# EAGLE design base-alt-pkg (EAGLE 9.2.0)
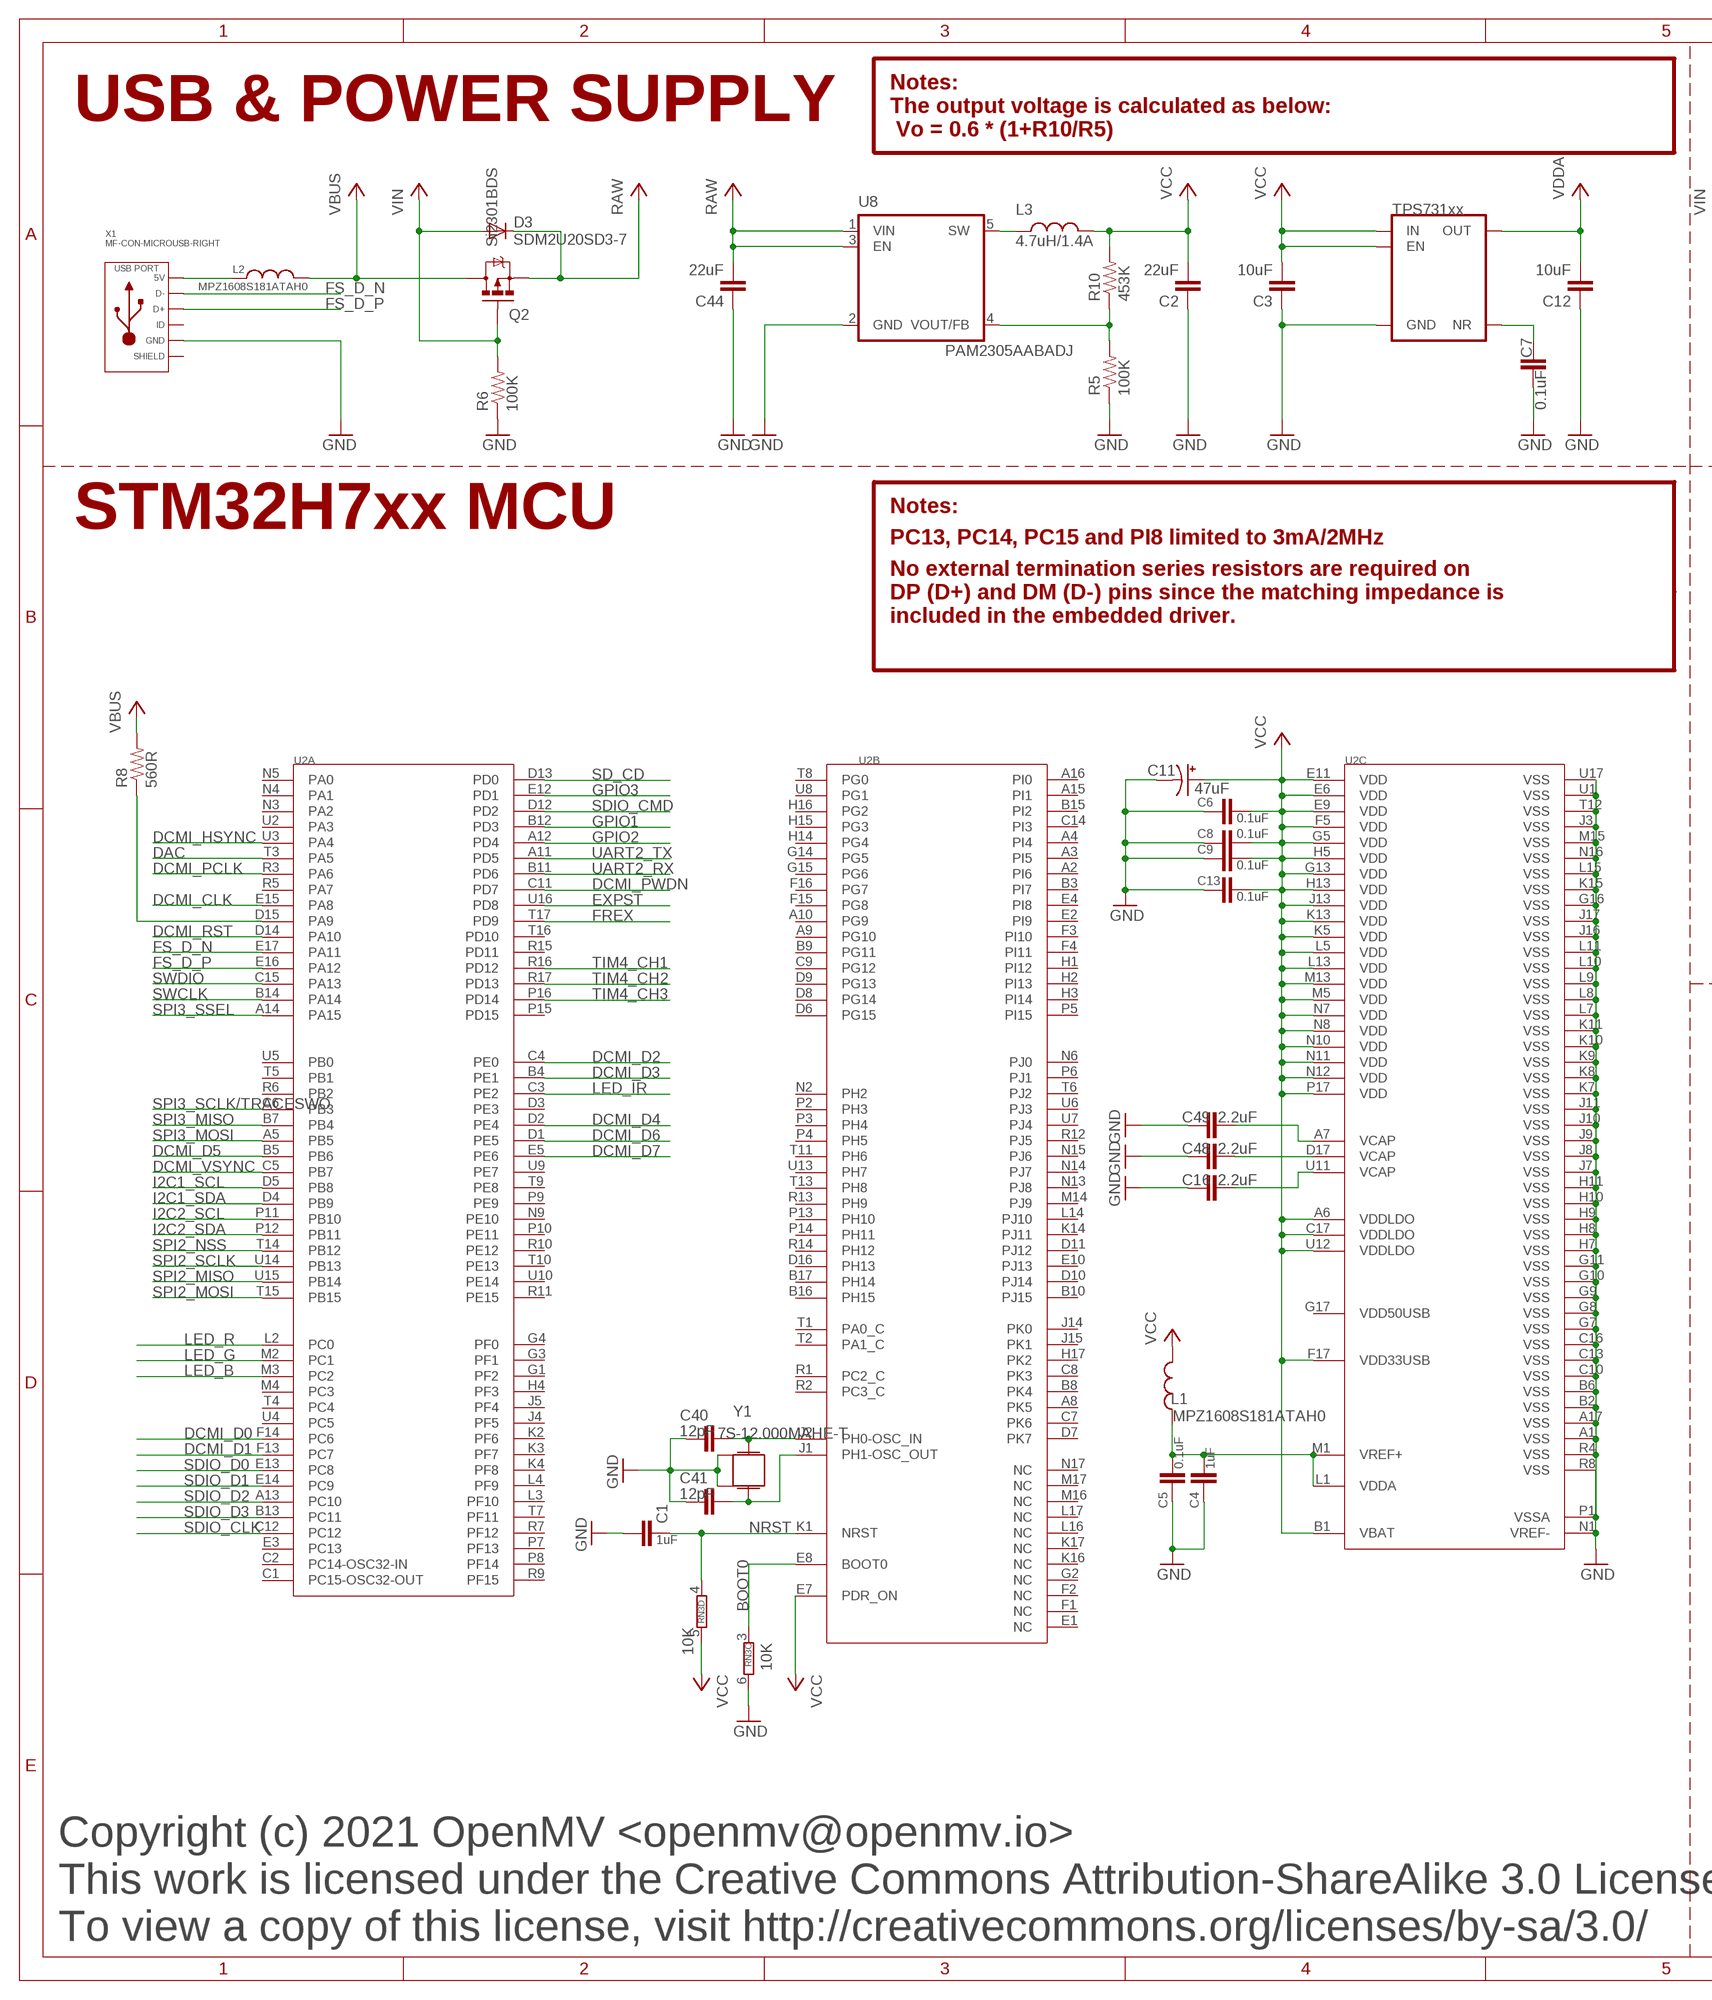
[diagram p0: schematic, sheet 1, part 1 of 2]
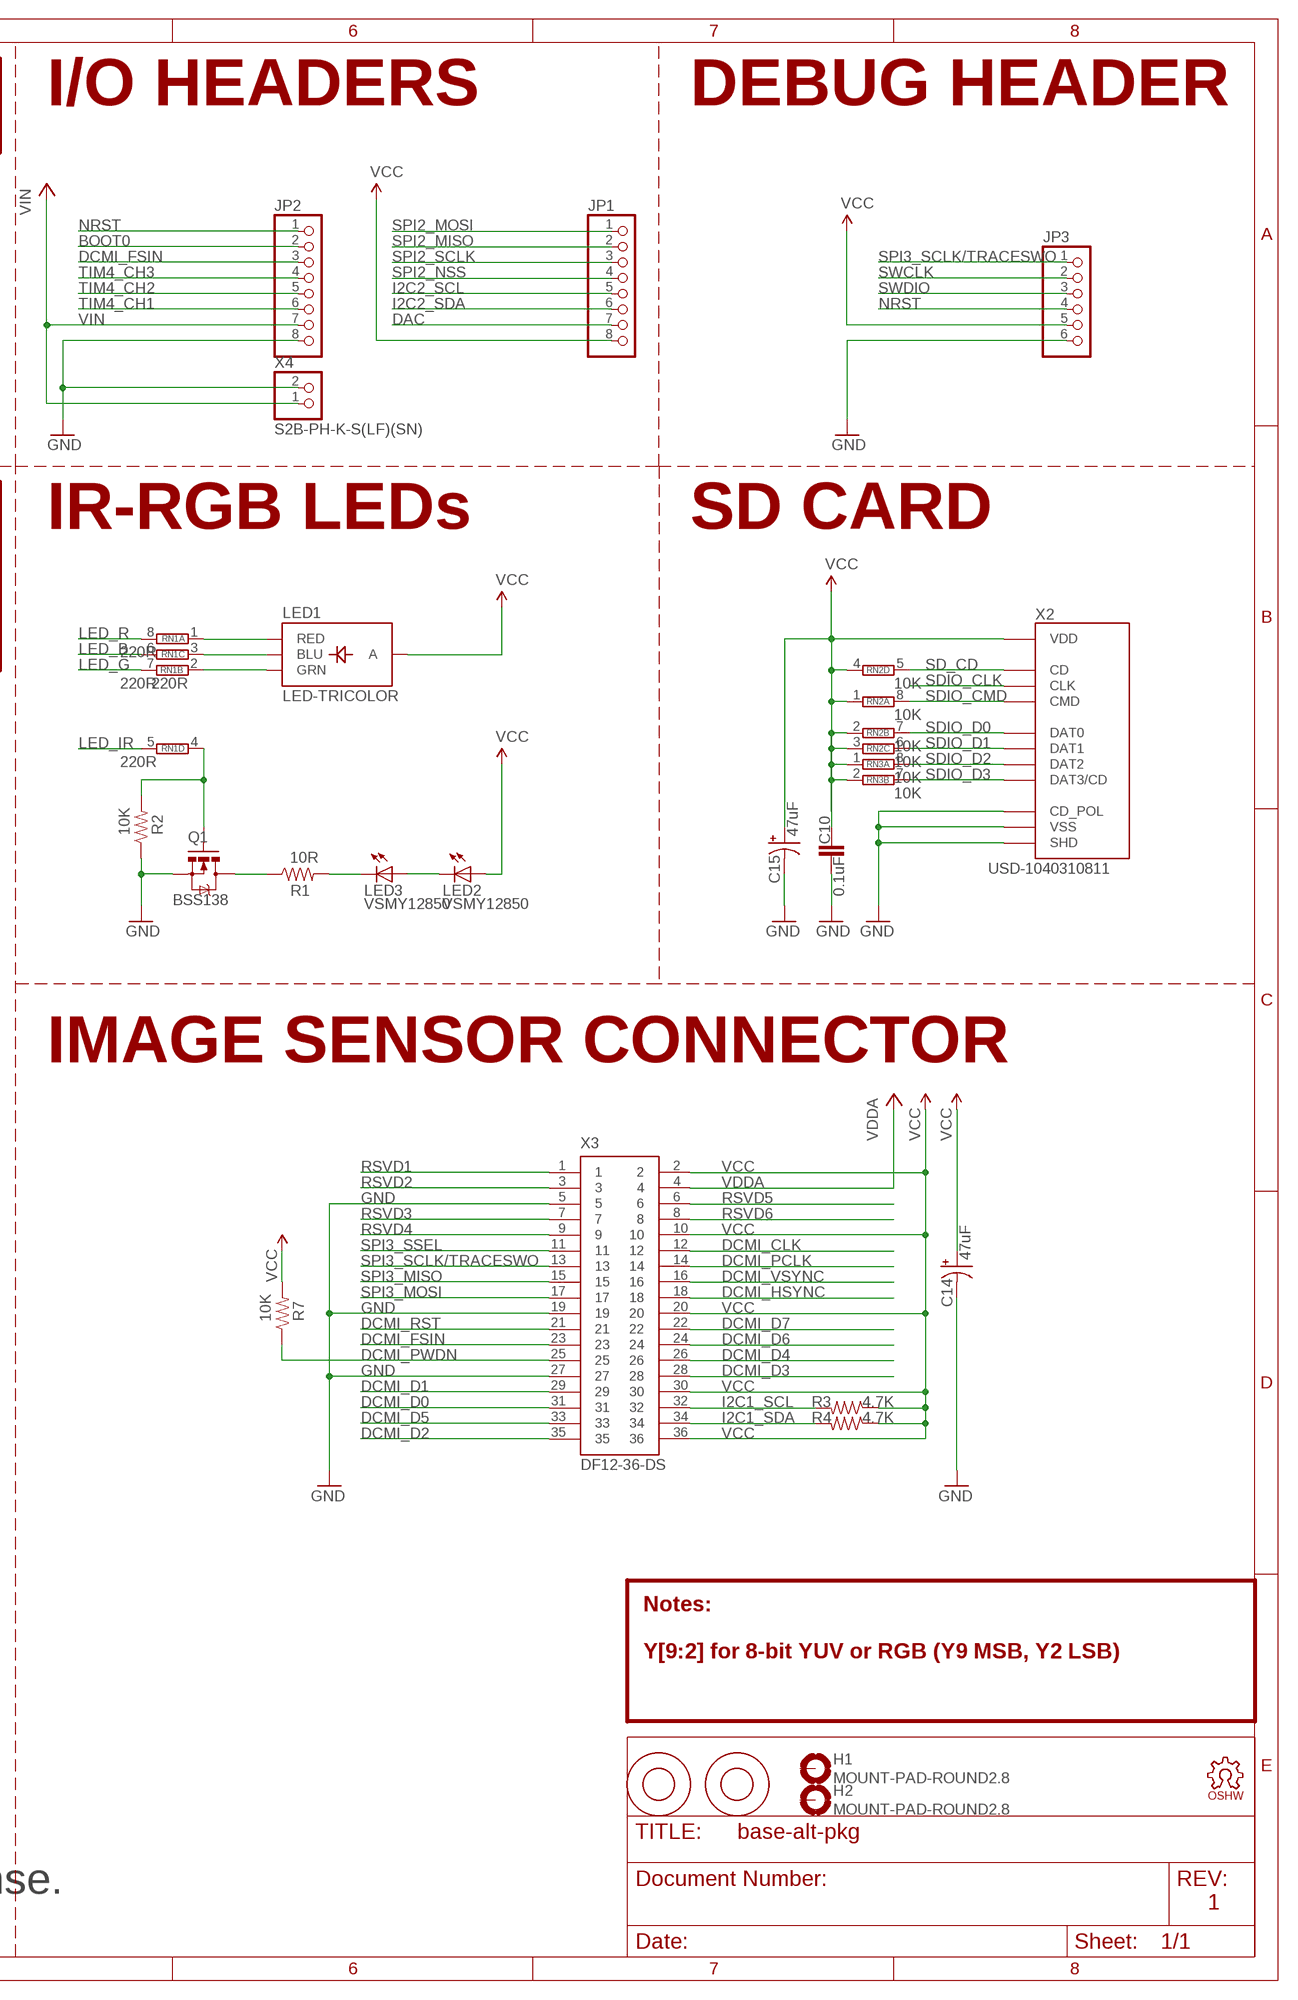
[diagram p1: schematic, sheet 1, part 2 of 2]

## Parts
C1  1uF  CAP0603-CAP  [0603-CAP]
C2  22uF  CAP0805  [0805]
C3  10uF  CAP0805  [0805]
C4  1uF  CAP0603-CAP  [0603-CAP]
C5  0.1uF  CAP0603-CAP  [0603-CAP]
C6  0.1uF  CAP0603-CAP  [0603-CAP]
C7  0.1uF  CAP0603-CAP  [0603-CAP]
C8  0.1uF  CAP0603-CAP  [0603-CAP]
C9  0.1uF  CAP0603-CAP  [0603-CAP]
C10  0.1uF  CAP0603-CAP  [0603-CAP]
C11  47uF  CAP_POL1206  [EIA3216]
C12  10uF  CAP0805  [0805]
C13  0.1uF  CAP0603-CAP  [0603-CAP]
C14  47uF  CAP_POL1206  [EIA3216]
C15  47uF  CAP_POL1206  [EIA3216]
C16  2.2uF  CAP0603-CAP  [0603-CAP]
C40  12pF  CAP0603-CAP  [0603-CAP]
C41  12pF  CAP0603-CAP  [0603-CAP]
C44  22uF  CAP0805  [0805]
C48  2.2uF  CAP0603-CAP  [0603-CAP]
C49  2.2uF  CAP0603-CAP  [0603-CAP]
D3  SDM2U20SD3-7  DIODESOD  [SOD-323]
H1  MOUNT-PAD-ROUND2.8  [2,8-PAD]
H2  MOUNT-PAD-ROUND2.8  [2,8-PAD]
JP1  PINHD-1X8  [1X08]
JP2  PINHD-1X8  [1X08]
JP3  PINHD-1X6  [1X06]
L1  MPZ1608S181ATAH0  INDUCTOR0603  [0603]
L2  MPZ1608S181ATAH0  INDUCTOR0603  [0603]
L3  4.7uH/1.4A  INDUCTOR1007  [1007]
LED1  LED-TRICOLOR  [LED-TRICOLOR-SMD-MF]
LED2  VSMY12850  LED1206  [LED-1206]
LED3  VSMY12850  LED1206  [LED-1206]
LOGO1  OSHW_LOGO_FILLX0100-NT  [OSHW_FILLX100_NOTEXT]
M1  9774030243R  9774030151R  [9774030151R]
M2  9774030243R  9774030151R  [9774030151R]
Q1  BSS138  MOSFET-NCHANNELSMD  [SOT23-3]
Q2  Si2301BDS  MOSFET-PCHANNELSMD  [SOT23-3]
R1  10R  RESISTOR0603-RES  [0603-RES]
R2  10K  RESISTOR0603-RES  [0603-RES]
R3  4.7K  RESISTOR0603-RES  [0603-RES]
R4  4.7K  RESISTOR0603-RES  [0603-RES]
R5  100K  RESISTOR0603-RES  [0603-RES]
R6  100K  RESISTOR0603-RES  [0603-RES]
R7  10K  RESISTOR0603-RES  [0603-RES]
R8  560R  RESISTOR0603-RES  [0603-RES]
R10  453K  RESISTOR0603-RES  [0603-RES]
RN1  220R  4R-NEXBV8V  [EXBV8V]
RN2  10K  4R-NEXBV8V  [EXBV8V]
RN3  10K  4R-NEXBV8V  [EXBV8V]
U2  STM32H743XIH6  STM32H743XIH6STM32H743XIH6_TFBGA240+25  [TFBGA240+25]
U5  TPS731XX  [SOT23-5]
U8  PAM2305AABADJ  PAM2305AAB330  [TSOT25]
X1  MF-CON-MICROUSB-RIGHT  USB_MICRO_RIGHT  [MICROUSB-RIGHT]
X2  USD-1040310811  [1040310811]
X3  DF12-36-DS  [DF12-36-DS]
X4  S2B-PH-K-S(LF)(SN)  JST_2PIN-THM-RA  [JST-PH-2-THM-RA]
Y1  7S-12.000MAHE-T  CRYSTAL2.5X2.0  [CRYSTAL-2.5X2.0]

## Nets
BOOT0: JP2.2 RN3.3 U2.E8(B:BOOT0)
DAC: JP1.7 U2.T3(A:PA5)
DCMI_CLK: U2.E15(A:PA8) X3.12
DCMI_D0: U2.F14(A:PC6) X3.31
DCMI_D1: U2.F13(A:PC7) X3.29
DCMI_D2: U2.C4(A:PE0) X3.35
DCMI_D3: U2.B4(A:PE1) X3.28
DCMI_D4: U2.D2(A:PE4) X3.26
DCMI_D5: U2.B5(A:PB6) X3.33
DCMI_D6: U2.D1(A:PE5) X3.24
DCMI_D7: U2.E5(A:PE6) X3.22
DCMI_FSIN: JP2.3 X3.23
DCMI_HSYNC: U2.U3(A:PA4) X3.18
DCMI_PCLK: U2.R3(A:PA6) X3.14
DCMI_PWDN: R7.1 U2.C11(A:PD7) X3.25
DCMI_RST: U2.D14(A:PA10) X3.21
DCMI_VSYNC: U2.C5(A:PB7) X3.16
EXPST: U2.U16(A:PD8)
FREX: U2.T17(A:PD9)
FS_D_N [USB_D]: U2.E17(A:PA11) X1.2(D-)
FS_D_P [USB_D]: U2.E16(A:PA12) X1.3(D+)
GND: C1.2 C2.1 C3.1 C4.2 C5.2 C6.2 C7.2 C8.2 C9.2 C10.2 C11.C(-) C12.1 C13.2 C14.C(-) C15.C(-) C16.2 C40.1 C41.1 C44.1 C48.2 C49.2 JP2.8 JP3.6 Q1.2(S) R2.1 R5.1 R6.1 RN3.6 U2.A1(C:VSS) U2.A17(C:VSS) U2.B2(C:VSS) U2.B6(C:VSS) U2.C10(C:VSS) U2.C13(C:VSS) U2.C16(C:VSS) U2.G7(C:VSS) U2.G8(C:VSS) U2.G9(C:VSS) U2.G10(C:VSS) U2.G11(C:VSS) U2.G16(C:VSS) U2.H7(C:VSS) U2.H8(C:VSS) U2.H9(C:VSS) U2.H10(C:VSS) U2.H11(C:VSS) U2.J3(C:VSS) U2.J7(C:VSS) U2.J8(C:VSS) U2.J9(C:VSS) U2.J10(C:VSS) U2.J11(C:VSS) U2.J16(C:VSS) U2.J17(C:VSS) U2.K7(C:VSS) U2.K8(C:VSS) U2.K9(C:VSS) U2.K10(C:VSS) U2.K11(C:VSS) U2.K15(C:VSS) U2.L7(C:VSS) U2.L8(C:VSS) U2.L9(C:VSS) U2.L10(C:VSS) U2.L11(C:VSS) U2.L15(C:VSS) U2.M15(C:VSS) U2.N1(C:VREF-) U2.N16(C:VSS) U2.P1(C:VSSA) U2.R4(C:VSS) U2.R8(C:VSS) U2.T12(C:VSS) U2.U1(C:VSS) U2.U17(C:VSS) U5.2(GND) U8.2(GND) X1.5(GND) X2.CD$2(CD_POL) X2.G$1(SHD) X2.G$2(SHD) X2.G$3(SHD) X2.G$4(SHD) X2.P$6(VSS) X3.5 X3.19 X3.27 X4.2 Y1.2 Y1.4
GPIO1: U2.B12(A:PD3)
GPIO2: U2.A12(A:PD4)
GPIO3: U2.E12(A:PD1)
I2C1_SCL: R3.2 U2.D5(A:PB8) X3.32
I2C1_SDA: R4.2 U2.D4(A:PB9) X3.34
I2C2_SCL: JP1.5 U2.P11(A:PB10)
I2C2_SDA: JP1.6 U2.P12(A:PB11)
LED_B: RN1.6 U2.M3(A:PC2)
LED_G: RN1.7 U2.M2(A:PC1)
LED_IR: RN1.5 U2.C3(A:PE2)
LED_R: RN1.8 U2.L2(A:PC0)
N$2: C40.2 U2.J2(B:PH0-OSC_IN) Y1.3
N$4: C41.2 U2.J1(B:PH1-OSC_OUT) Y1.1
N$5: Q1.1(G) R2.2 RN1.4
N$6: LED1.B(BLU) RN1.3
N$7: L2.1 X1.1(5V)
N$8: LED1.R(RED) RN1.1
N$9: LED1.G(GRN) RN1.2
N$10: LED3.C R1.2
N$11: C7.1 U5.4(NR)
N$13: R5.2 R10.1 U8.4(VOUT/FB)
N$14: Q1.3(D) R1.1
N$17: LED2.C LED3.A
N$31: R8.1 U2.D15(A:PA9)
N$32: C4.1 C5.1 L1.1 U2.L1(C:VDDA) U2.M1(C:VREF+)
N$33: C49.1 U2.A7(C:VCAP)
N$34: C48.1 U2.D17(C:VCAP)
N$35: C16.1 U2.U11(C:VCAP)
NRST: C1.1 JP2.1 JP3.4 RN3.4 U2.K1(B:NRST)
RAW: C44.2 D3.1(C) Q2.2(S) U8.1(VIN) U8.3(EN)
RSVD1: X3.1
RSVD2: X3.3
RSVD3: X3.7
RSVD4: X3.9
RSVD5: X3.6
RSVD6: X3.8
SD_CD: RN2.5 U2.D13(A:PD0) X2.CD$1(CD)
SDIO_CLK: U2.C12(A:PC12) X2.P$5(CLK)
SDIO_CMD: RN2.8 U2.D12(A:PD2) X2.P$3(CMD)
SDIO_D0: RN2.7 U2.E13(A:PC8) X2.P$7(DAT0)
SDIO_D1: RN2.6 U2.E14(A:PC9) X2.P$8(DAT1)
SDIO_D2: RN3.8 U2.A13(A:PC10) X2.P$1(DAT2)
SDIO_D3: RN3.7 U2.B13(A:PC11) X2.P$2(DAT3/CD)
SPI2_MISO: JP1.2 U2.U15(A:PB14)
SPI2_MOSI: JP1.1 U2.T15(A:PB15)
SPI2_NSS: JP1.4 U2.T14(A:PB12)
SPI2_SCLK: JP1.3 U2.U14(A:PB13)
SPI3_MISO: U2.B7(A:PB4) X3.15
SPI3_MOSI: U2.A5(A:PB5) X3.17
SPI3_SCLK/TRACESWO: JP3.1 U2.C6(A:PB3) X3.13
SPI3_SSEL: U2.A14(A:PA15) X3.11
SW: L3.1 U8.5(SW)
SWCLK: JP3.2 U2.B14(A:PA14)
SWDIO: JP3.3 U2.C15(A:PA13)
TIM4_CH1: JP2.6 U2.R16(A:PD12)
TIM4_CH2: JP2.5 U2.R17(A:PD13)
TIM4_CH3: JP2.4 U2.P16(A:PD14)
UART2_RX: U2.B11(A:PD6)
UART2_TX: U2.A11(A:PD5)
VBUS: L2.2 Q2.3(D) R8.2
VCC: C2.2 C3.2 C6.1 C8.1 C9.1 C10.1 C11.A(+) C13.1 C14.A(+) C15.A(+) JP1.8 JP3.5 L1.2 L3.2 LED1.A LED2.A R3.1 R4.1 R7.2 R10.2 RN2.1 RN2.2 RN2.3 RN2.4 RN3.1 RN3.2 RN3.5 U2.A6(C:VDDLDO) U2.B1(C:VBAT) U2.C17(C:VDDLDO) U2.E6(C:VDD) U2.E7(B:PDR_ON) U2.E9(C:VDD) U2.E11(C:VDD) U2.F5(C:VDD) U2.F17(C:VDD33USB) U2.G5(C:VDD) U2.G13(C:VDD) U2.H5(C:VDD) U2.H13(C:VDD) U2.J13(C:VDD) U2.K5(C:VDD) U2.K13(C:VDD) U2.L5(C:VDD) U2.L13(C:VDD) U2.M5(C:VDD) U2.M13(C:VDD) U2.N7(C:VDD) U2.N8(C:VDD) U2.N10(C:VDD) U2.N11(C:VDD) U2.N12(C:VDD) U2.P17(C:VDD) U2.U12(C:VDDLDO) U5.1(IN) U5.3(EN) X2.P$4(VDD) X3.2 X3.10 X3.20 X3.30 X3.36
VDDA: C12.2 U5.5(OUT) X3.4
VIN: D3.2(A) JP2.7 Q2.1(G) R6.2 X4.1
Unconnected: H1.B2,8(MOUNT) H2.B2,8(MOUNT) U2.A2(B:PI6) U2.A3(B:PI5) U2.A4(B:PI4) U2.A8(B:PK5) U2.A9(B:PG10) U2.A10(B:PG9) U2.A15(B:PI1) U2.A16(B:PI0) U2.B3(B:PI7) U2.B8(B:PK4) U2.B9(B:PG11) U2.B10(B:PJ15) U2.B15(B:PI2) U2.B16(B:PH15) U2.B17(B:PH14) U2.C1(A:PC15-OSC32-OUT) U2.C2(A:PC14-OSC32-IN) U2.C7(B:PK6) U2.C8(B:PK3) U2.C9(B:PG12) U2.C14(B:PI3) U2.D3(A:PE3) U2.D6(B:PG15) U2.D7(B:PK7) U2.D8(B:PG14) U2.D9(B:PG13) U2.D10(B:PJ14) U2.D11(B:PJ12) U2.D16(B:PH13) U2.E1(B:NC) U2.E2(B:PI9) U2.E3(A:PC13) U2.E4(B:PI8) U2.E10(B:PJ13) U2.F1(B:NC) U2.F2(B:NC) U2.F3(B:PI10) U2.F4(B:PI11) U2.F15(B:PG8) U2.F16(B:PG7) U2.G1(A:PF2) U2.G2(B:NC) U2.G3(A:PF1) U2.G4(A:PF0) U2.G14(B:PG5) U2.G15(B:PG6) U2.G17(C:VDD50USB) U2.H1(B:PI12) U2.H2(B:PI13) U2.H3(B:PI14) U2.H4(A:PF3) U2.H14(B:PG4) U2.H15(B:PG3) U2.H16(B:PG2) U2.H17(B:PK2) U2.J4(A:PF5) U2.J5(A:PF4) U2.J14(B:PK0) U2.J15(B:PK1) U2.K2(A:PF6) U2.K3(A:PF7) U2.K4(A:PF8) U2.K14(B:PJ11) U2.K16(B:NC) U2.K17(B:NC) U2.L3(A:PF10) U2.L4(A:PF9) U2.L14(B:PJ10) U2.L16(B:NC) U2.L17(B:NC) U2.M4(A:PC3) U2.M14(B:PJ9) U2.M16(B:NC) U2.M17(B:NC) U2.N2(B:PH2) U2.N3(A:PA2) U2.N4(A:PA1) U2.N5(A:PA0) U2.N6(B:PJ0) U2.N9(A:PE10) U2.N13(B:PJ8) U2.N14(B:PJ7) U2.N15(B:PJ6) U2.N17(B:NC) U2.P2(B:PH3) U2.P3(B:PH4) U2.P4(B:PH5) U2.P5(B:PI15) U2.P6(B:PJ1) U2.P7(A:PF13) U2.P8(A:PF14) U2.P9(A:PE9) U2.P10(A:PE11) U2.P13(B:PH10) U2.P14(B:PH11) U2.P15(A:PD15) U2.R1(B:PC2_C) U2.R2(B:PC3_C) U2.R5(A:PA7) U2.R6(A:PB2) U2.R7(A:PF12) U2.R9(A:PF15) U2.R10(A:PE12) U2.R11(A:PE15) U2.R12(B:PJ5) U2.R13(B:PH9) U2.R14(B:PH12) U2.R15(A:PD11) U2.T1(B:PA0_C) U2.T2(B:PA1_C) U2.T4(A:PC4) U2.T5(A:PB1) U2.T6(B:PJ2) U2.T7(A:PF11) U2.T8(B:PG0) U2.T9(A:PE8) U2.T10(A:PE13) U2.T11(B:PH6) U2.T13(B:PH8) U2.T16(A:PD10) U2.U2(A:PA3) U2.U4(A:PC5) U2.U5(A:PB0) U2.U6(B:PJ3) U2.U7(B:PJ4) U2.U8(B:PG1) U2.U9(A:PE7) U2.U10(A:PE14) U2.U13(B:PH7) X1.4(ID) X1.S1(SLD) X1.S2(SLD) X1.S3(SLD) X1.S4(SLD) X1.S5(SLD) X1.S6(SLD)

## Notes on the sheet
- Notes:
- USB & POWER SUPPLY | I/O HEADERS | DEBUG HEADER
- The output voltage is calculated as below:
   Vo = 0.6 * (1+R10/R5)
- Notes:
- STM32H7xx MCU | IR-RGB LEDs | SD CARD
- PC13, PC14, PC15 and PI8 limited to 3mA/2MHz
- No external termination series resistors are required on
  DP (D+) and DM (D-) pins since the matching impedance is
  included in the embedded driver.
- IMAGE SENSOR CONNECTOR
- Notes:
- Y[9:2] for 8-bit YUV or RGB (Y9 MSB, Y2 LSB)
- Copyright (c) 2021 OpenMV <openmv@openmv.io>
- This work is licensed under the Creative Commons Attribution-ShareAlike 3.0 License.
- 1
- To view a copy of this license, visit http://creativecommons.org/licenses/by-sa/3.0/

## Library data of the parts
C1-C10 C12 C13 C16 C40 C41 C44 C48 C49 = sfe:CAP: Capacitor Standard 0603 ceramic capacitor, and 0.1" leaded capacitor.
C11 C14 C15 = sfe:CAP_POL: Capacitor Polarized These are standard SMD and PTH capacitors. Normally 10uF, 47uF, and 100uF in electrolytic and tantalum varieties. Always verify the external diameter of the through hole cap, it varies with capacity, voltage, and manufacturer. The EIA devices should be standard.
D3 = sfe:DIODE: Diode These are standard reverse protection diodes and small signal diodes. SMA package can handle up to about 1A. SOD-323 can handle about 200mA. What the SOD-323 package when ordering, there are some mfgs out there that are 5-pin packages.
H1 H2 = holes:MOUNT-PAD-ROUND: MOUNTING PAD, round
JP1 JP2 = pinhead:PINHD-1X8: PIN HEADER
JP3 = pinhead:PINHD-1X6: PIN HEADER
L1-L3 = sfe:INDUCTOR: Inductors Basic Inductor/Choke - 0603 and 1206. Footprints are not proven and vary greatly between part numbers.
LED1 = sfe:LED-TRICOLOR: Tri-Color LED SMD Proven layout and schematic for triple color LED in SMD package - common anode. Spark Fun Electronics SKU : COM-07844
LED2 LED3 = sfe:LED: LEDs Standard schematic elements and footprints for 5mm, 3mm, 1206, and 0603 sized LEDs. 5mm - Spark Fun Electronics SKU : COM-00529 (and others)
LOGO1 = iofault:OSHW_LOGO_FILL
M1 M2 = STANDOFFS:9774030151R
Q1 = sfe:MOSFET-NCHANNEL
Q2 = sfe:MOSFET-PCHANNEL
R1-R8 R10 = sfe:RESISTOR: Resistor Basic schematic elements and footprints for 0603, 1206, and PTH resistors.
RN1-RN3 = resistor-dil:4R-N: Array Chip Resistor Source: RS Component / Phycomp; OC_FARNELL: unknown; OC_NEWARK: unknown
U2 = openMV-h7update:STM32H743XIH6: ARMR CortexR-M7 STM32H7 Microcontroller IC 32-Bit 480MHz 2MB (2M x 8) FLASH 240+25-TFBGA (14x14); COST: 15.83; DISTRIBUTOR: DIGIKEY; DISTRIBUTOR_P/N: 497-17724-ND; MANUFACTURER: STMicroelectronics; MANUFACTURER_P/N: STM32H743XIH6
U5 = mux:TPS731XX
U8 = regulators:PAM2305AAB330
X1 = MF_Connectors:USB: Library: MF_Connectors Description: 5 Pin USB Connectors. SLD is the shield connection. Usually tied to ground through a small ferrite bead.
X2 = molex:USD-1040310811
X3 = DF12:DF12-36-DS
X4 = adafruit-updated:JST_2PIN: JST 2-Pin Connectors of various flavors SMT-RA (S2B-PH-SM4) 4UConnector #17311 SMT (B2B-PH-SM4) THM-RA (S2B-PH) THM (B2B-PH)
Y1 = mux:CRYSTAL: Crystals Various standard crystals. Proven footprints. Spark Fun Electronics SKU : COM-00534

## Net classes
1 USB_D: width 0.22 mm, clearance 0.127 mm

## Board
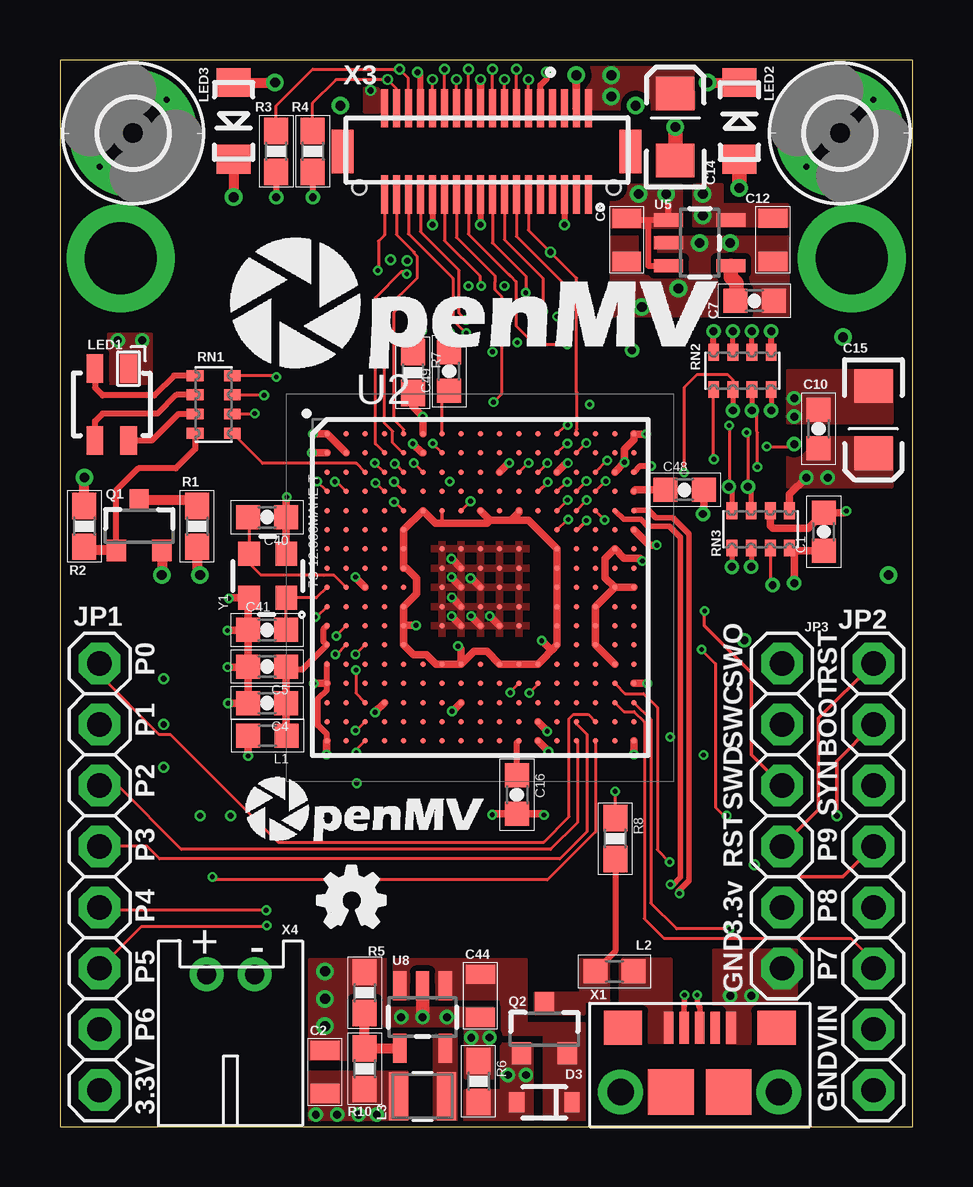
[diagram p2: board, top side]
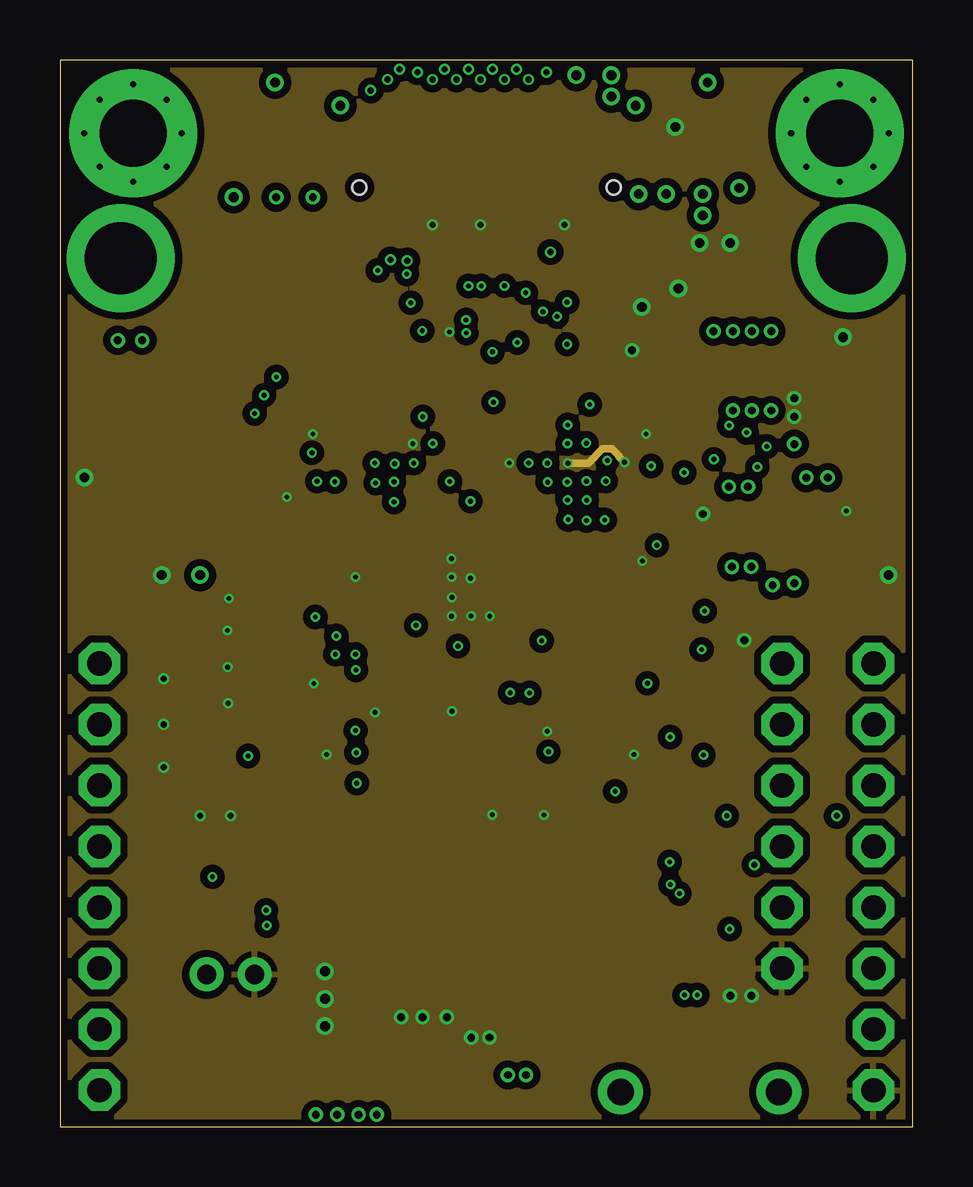
[diagram p3: board, inner layer GND]
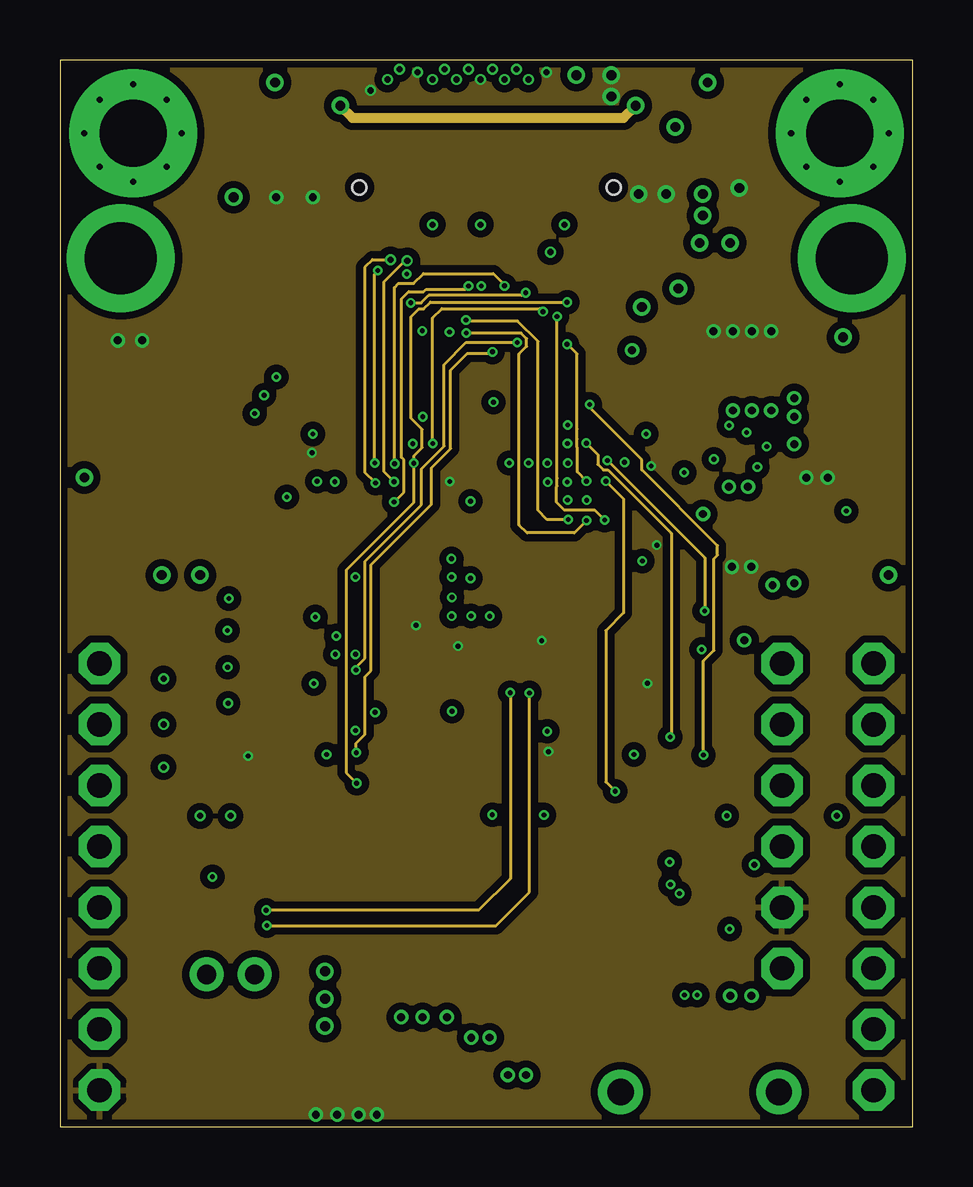
[diagram p4: board, inner layer VCC]
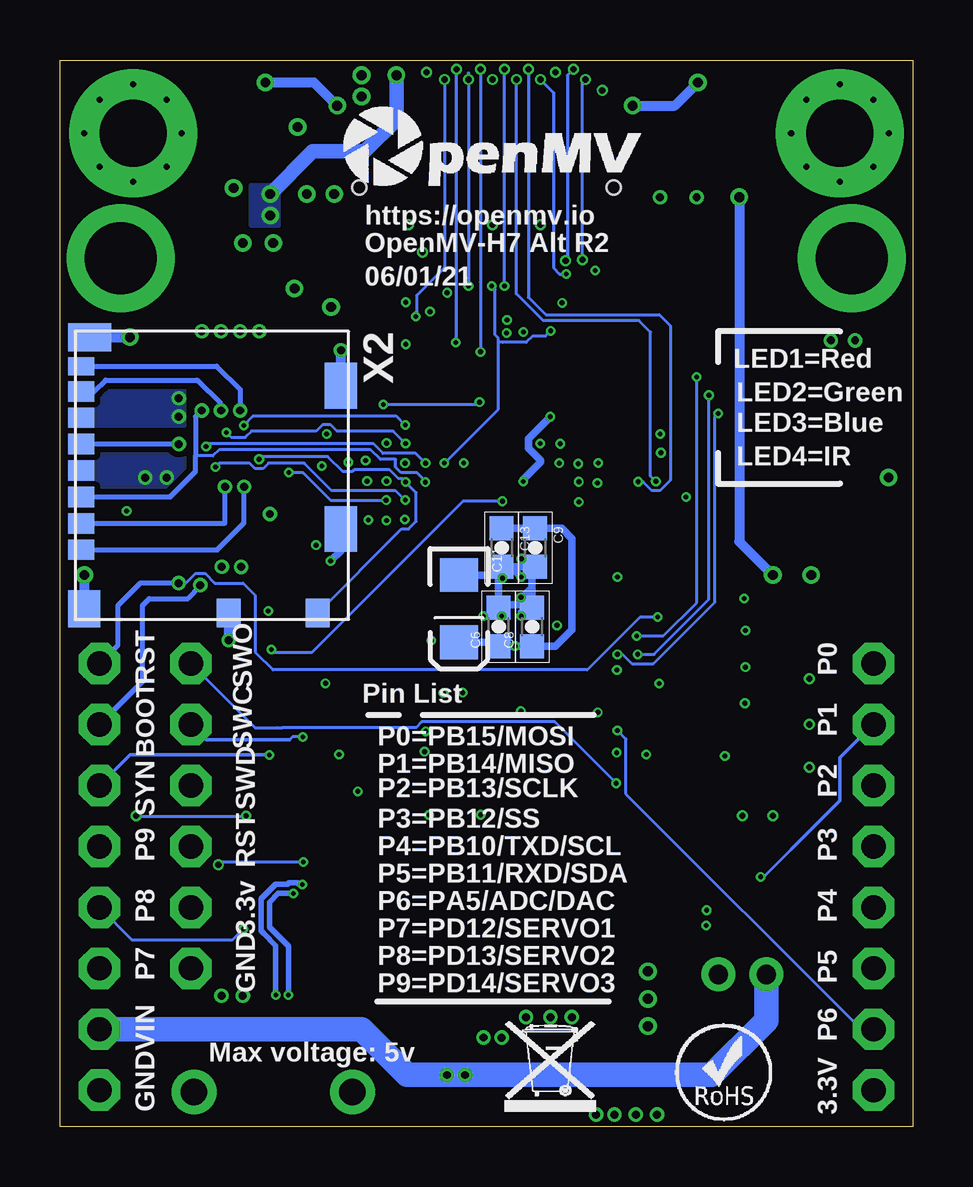
[diagram p5: board, bottom side, seen from below]

Size 35.56 x 44.45 mm. Coordinates in mm from the lower left corner, seen from the top.
Outline: 0,44.45 0,0 35.56,0 35.56,44.45 0,44.45
Copper layers (1*2+15*16): Top 0.035mm / dielectric 1.5mm / GND 0.035mm / dielectric 0.15mm / VCC 0.035mm / dielectric 0.2mm / Bottom 0.035mm
Design rules "default *": minimum track width 5mil, minimum drill 0.19811875mm, track to track 5mil, track to pad 5mil, pad to pad 5mil, via to via 5mil, smd to smd 5mil, copper to edge 5mil, drill to drill 10mil, minimum pad ring 10mil, minimum via ring 4mil, stop-mask expansion 2mil, vias tented up to drill 30mil, thermal gap 10mil

### Footprints (pad centres in the part's own frame; a part is rotated, then mirrored left to right if it is on the bottom)
0603-CAP = smd 1 x 1: 1 -0.8,0; 2 0.8,0
0805 = smd 0.8 x 1.2: 1 -0.9,0; 2 0.9,0
EIA3216 = smd 1.4 x 1.6: A 1.4,0; C -1.4,0
SOD-323 = smd 0.63 x 0.83: 1 -1.15,0; 2 1.15,0
2,8-PAD = drill 2.8 pad 5.334: B2,8 0,0
1X08 = drill 1.016 octagon: 1 -8.89,0; 2 -6.35,0; 3 -3.81,0; 4 -1.27,0; 5 1.27,0; 6 3.81,0; 7 6.35,0; 8 8.89,0
1X06 = drill 1.016 octagon: 1 -6.35,0; 2 -3.81,0; 3 -1.27,0; 4 1.27,0; 5 3.81,0; 6 6.35,0
0603 = smd 1 x 1: 1 -0.8,0; 2 0.8,0
1007 = smd 2 x 0.8: 1 0,1; 2 0,-1
LED-TRICOLOR-SMD-MF = smd 0.7 x 1.2: A 0.7,1.5; B 0.7,-1.5; G -0.7,-1.5; R -0.7,1.5
LED-1206 = smd 1.2 x 1.4: A -1.6,0; C 1.6,0
9774030151R = drill 3 pad 4.5: P$1 0,0
SOT23-3 = smd 0.8 x 0.9: 1 -0.95,-1; 2 0.95,-1; 3 0,1.1
0603-RES = smd 1.1 x 1: 1 -0.85,0; 2 0.85,0
EXBV8V = smd 0.45 x 0.7: 1 -1.2,-0.775; 2 -0.4,-0.775; 3 0.4,-0.775; 4 1.2,-0.775; 5 1.2,0.775; 6 0.4,0.775; 7 -0.4,0.775; 8 -1.2,0.775
TFBGA240+25 = smd 0.225 x 0.225: A1 -6.4,6.4; A2 -5.6,6.4; A3 -4.8,6.4; A4 -4,6.4; A5 -3.2,6.4; A6 -2.4,6.4; A7 -1.6,6.4; A8 -0.8,6.4; A9 0,6.4; A10 0.8,6.4; A11 1.6,6.4; A12 2.4,6.4; A13 3.2,6.4; A14 4,6.4; A15 4.8,6.4; A16 5.6,6.4; A17 6.4,6.4; B1 -6.4,5.6; B2 -5.6,5.6; B3 -4.8,5.6; B4 -4,5.6; B5 -3.2,5.6; B6 -2.4,5.6; B7 -1.6,5.6; B8 -0.8,5.6; B9 0,5.6; B10 0.8,5.6; B11 1.6,5.6; B12 2.4,5.6; B13 3.2,5.6; B14 4,5.6; B15 4.8,5.6; B16 5.6,5.6; B17 6.4,5.6; C1 -6.4,4.8; C2 -5.6,4.8; C3 -4.8,4.8; C4 -4,4.8; C5 -3.2,4.8; C6 -2.4,4.8; C7 -1.6,4.8; C8 -0.8,4.8; C9 0,4.8; C10 0.8,4.8; C11 1.6,4.8; C12 2.4,4.8; C13 3.2,4.8; C14 4,4.8; C15 4.8,4.8; C16 5.6,4.8; C17 6.4,4.8; D1 -6.4,4; D2 -5.6,4; D3 -4.8,4; D4 -4,4; D5 -3.2,4; D6 -2.4,4; D7 -1.6,4; D8 -0.8,4; D9 0,4; D10 0.8,4; D11 1.6,4; D12 2.4,4; D13 3.2,4; D14 4,4; D15 4.8,4; D16 5.6,4; D17 6.4,4; E1 -6.4,3.2; E2 -5.6,3.2; E3 -4.8,3.2; E4 -4,3.2; E5 -3.2,3.2; E6 -2.4,3.2; E7 -1.6,3.2; E8 -0.8,3.2; E9 0,3.2; E10 0.8,3.2; E11 1.6,3.2; E12 2.4,3.2; E13 3.2,3.2; E14 4,3.2; E15 4.8,3.2; E16 5.6,3.2; E17 6.4,3.2; F1 -6.4,2.4; F2 -5.6,2.4; F3 -4.8,2.4; F4 -4,2.4; F5 -3.2,2.4; F13 3.2,2.4; F14 4,2.4; F15 4.8,2.4; F16 5.6,2.4; F17 6.4,2.4; G1 -6.4,1.6; G2 -5.6,1.6; G3 -4.8,1.6; G4 -4,1.6; G5 -3.2,1.6; G7 -1.6,1.6; G8 -0.8,1.6; G9 0,1.6; G10 0.8,1.6; G11 1.6,1.6; G13 3.2,1.6; G14 4,1.6; G15 4.8,1.6; G16 5.6,1.6; G17 6.4,1.6; H1 -6.4,0.8; H2 -5.6,0.8; H3 -4.8,0.8; H4 -4,0.8; H5 -3.2,0.8; H7 -1.6,0.8; H8 -0.8,0.8; H9 0,0.8; H10 0.8,0.8; H11 1.6,0.8; H13 3.2,0.8; H14 4,0.8; H15 4.8,0.8; H16 5.6,0.8; H17 6.4,0.8; J1 -6.4,0; J2 -5.6,0; J3 -4.8,0; J4 -4,0; J5 -3.2,0; J7 -1.6,0; J8 -0.8,0; J9 0,0; J10 0.8,0; J11 1.6,0; J13 3.2,0; J14 4,0; J15 4.8,0; J16 5.6,0; J17 6.4,0; K1 -6.4,-0.8; K2 -5.6,-0.8; K3 -4.8,-0.8; K4 -4,-0.8; K5 -3.2,-0.8; K7 -1.6,-0.8; K8 -0.8,-0.8; K9 0,-0.8; K10 0.8,-0.8; K11 1.6,-0.8; K13 3.2,-0.8; K14 4,-0.8; K15 4.8,-0.8; K16 5.6,-0.8; K17 6.4,-0.8; L1 -6.4,-1.6; L2 -5.6,-1.6; L3 -4.8,-1.6; L4 -4,-1.6; L5 -3.2,-1.6; L7 -1.6,-1.6; L8 -0.8,-1.6; L9 0,-1.6; L10 0.8,-1.6; L11 1.6,-1.6; L13 3.2,-1.6; L14 4,-1.6; L15 4.8,-1.6; L16 5.6,-1.6; L17 6.4,-1.6; M1 -6.4,-2.4; M2 -5.6,-2.4; M3 -4.8,-2.4; M4 -4,-2.4; M5 -3.2,-2.4; M13 3.2,-2.4; M14 4,-2.4; M15 4.8,-2.4; M16 5.6,-2.4; M17 6.4,-2.4; N1 -6.4,-3.2; N2 -5.6,-3.2; N3 -4.8,-3.2; N4 -4,-3.2; N5 -3.2,-3.2; N6 -2.4,-3.2; N7 -1.6,-3.2; N8 -0.8,-3.2; N9 0,-3.2; N10 0.8,-3.2; N11 1.6,-3.2; N12 2.4,-3.2; N13 3.2,-3.2; N14 4,-3.2; N15 4.8,-3.2; N16 5.6,-3.2; N17 6.4,-3.2; P1 -6.4,-4; P2 -5.6,-4; P3 -4.8,-4; P4 -4,-4; P5 -3.2,-4; P6 -2.4,-4; P7 -1.6,-4; P8 -0.8,-4; P9 0,-4; P10 0.8,-4; P11 1.6,-4; P12 2.4,-4; P13 3.2,-4; P14 4,-4; P15 4.8,-4; P16 5.6,-4; P17 6.4,-4; R1 -6.4,-4.8; R2 -5.6,-4.8; R3 -4.8,-4.8; R4 -4,-4.8; R5 -3.2,-4.8; R6 -2.4,-4.8; R7 -1.6,-4.8; R8 -0.8,-4.8; R9 0,-4.8; R10 0.8,-4.8; R11 1.6,-4.8; R12 2.4,-4.8; R13 3.2,-4.8; R14 4,-4.8; R15 4.8,-4.8; R16 5.6,-4.8; R17 6.4,-4.8; T1 -6.4,-5.6; T2 -5.6,-5.6; T3 -4.8,-5.6; T4 -4,-5.6; T5 -3.2,-5.6; T6 -2.4,-5.6; T7 -1.6,-5.6; T8 -0.8,-5.6; T9 0,-5.6; T10 0.8,-5.6; T11 1.6,-5.6; T12 2.4,-5.6; T13 3.2,-5.6; T14 4,-5.6; T15 4.8,-5.6; T16 5.6,-5.6; T17 6.4,-5.6; U1 -6.4,-6.4; U2 -5.6,-6.4; U3 -4.8,-6.4; U4 -4,-6.4; U5 -3.2,-6.4; U6 -2.4,-6.4; U7 -1.6,-6.4; U8 -0.8,-6.4; U9 0,-6.4; U10 0.8,-6.4; U11 1.6,-6.4; U12 2.4,-6.4; U13 3.2,-6.4; U14 4,-6.4; U15 4.8,-6.4; U16 5.6,-6.4; U17 6.4,-6.4
SOT23-5 = smd 0.55 x 1.2: 1 -0.95,-1.3; 2 0,-1.3; 3 0.95,-1.3; 4 0.95,1.3; 5 -0.95,1.3
TSOT25 = smd 0.55 x 1.2: 1 -0.95,-1.3; 2 0,-1.3; 3 0.95,-1.3; 4 0.95,1.3; 5 -0.95,1.3
MICROUSB-RIGHT = smd 0.4 x 1.35: 1 -1.3,1.27; 2 -0.65,1.27; 3 0,1.27; 4 0.65,1.27; 5 1.3,1.27 | drill 1.1: S1 -3.3,-1.405; S2 3.3,-1.405 | smd 1.6 x 1.4: S3 -3.2,1.27; S4 3.2,1.27 | smd 1.9 x 1.9: S5 -1.2,-1.405; S6 1.2,-1.405
1040310811 = smd 1.2 x 1: CD$1 11.74,10.1; CD$2 11.74,6.4 | smd 1.55 x 1.35: G$1 11.565,0.375 | smd 1.17 x 1.8: G$2 0.245,0.6 | smd 1.9 x 1.35: G$3 2.27,11.075; G$4 8.24,11.075 | smd 0.85 x 1.1: P$1 9.105,0.25; P$2 8.005,0.25; P$3 6.905,0.25; P$4 5.805,0.25; P$5 4.705,0.25; P$6 3.605,0.25; P$7 2.505,0.25 | smd 0.75 x 1.1: P$8 1.455,0.25
DF12-36-DS = smd 0.3 x 1.6: 1 4.25,-1.8; 2 4.25,1.8; 3 3.75,-1.8; 4 3.75,1.8; 5 3.25,-1.8; 6 3.25,1.8; 7 2.75,-1.8; 8 2.75,1.8; 9 2.25,-1.8; 10 2.25,1.8; 11 1.75,-1.8; 12 1.75,1.8; 13 1.25,-1.8; 14 1.25,1.8; 15 0.75,-1.8; 16 0.75,1.8; 17 0.25,-1.8; 18 0.25,1.8; 19 -0.25,-1.8; 20 -0.25,1.8; 21 -0.75,-1.8; 22 -0.75,1.8; 23 -1.25,-1.8; 24 -1.25,1.8; 25 -1.75,-1.8; 26 -1.75,1.8; 27 -2.25,-1.8; 28 -2.25,1.8; 29 -2.75,-1.8; 30 -2.75,1.8; 31 -3.25,-1.8; 32 -3.25,1.8; 33 -3.75,-1.8; 34 -3.75,1.8; 35 -4.25,-1.8; 36 -4.25,1.8 | smd 0.9 x 1.8: F1 6,0; F2 -6,0 | hole 0.6: 5.3,-1.5; -5.3,-1.5
JST-PH-2-THM-RA = drill 0.8 pad 1.422: 1 1,0; 2 -1,0
CRYSTAL-2.5X2.0 = smd 1 x 0.9: 1 -0.95,-0.8; 2 0.9,-0.8; 3 0.9,0.75; 4 -0.95,0.75

### Placement (x,y rotation side)
C1  31.84,24.8 90 top
C2  11.05,2.29 270 top
C3  23.62,36.96 90 top
C4  8.64,17.65 180 top
C5  8.64,19.18 180 top
C6  17.27,20.83 90 bottom
C7  28.96,34.42 0 top
C8  15.88,20.83 90 bottom
C9  15.75,24.13 270 bottom
C10  31.62,29.08 90 top
C11  18.92,21.59 270 bottom
C12  29.72,36.96 90 top
C13  17.14,24.13 270 bottom
C14  25.65,41.66 90 top
C15  33.91,29.46 270 top
C16  19.05,13.84 270 top
C40  8.64,25.4 180 top
C41  8.64,20.7 0 top
C44  17.53,5.46 90 top
C48  26.04,26.54 0 top
C49  16.22,31.48 90 top
D3  20.19,1.02 180 top
H1  3.05,41.4 90 top
H2  32.51,41.4 270 top
JP1  1.65,10.41 270 top
JP2  33.91,10.41 270 top
JP3  30.1,12.95 270 top
L1  8.65,16.3 180 top
L2  23.11,6.48 180 top
L3  15.11,1.27 270 top
LED1  2.16,30.1 0 top
LED2  28.32,41.91 90 top
LED3  7.24,41.91 270 top
LOGO1  10.74,8.31 0 top
M1  2.54,36.2 0 top
M2  33.02,36.2 0 top
Q1  3.3,25.02 0 top
Q2  20.19,4.06 0 top
R1  5.71,25.02 270 top
R2  1.02,25.02 270 top
R3  9.02,40.64 90 top
R4  10.54,40.64 90 top
R5  12.7,5.59 270 top
R6  17.44,1.89 270 top
R7  14.71,31.42 270 top
R8  23.15,12.01 270 top
R10  12.7,2.41 270 top
RN1  6.41,30.1 270 top
RN2  28.45,31.5 180 top
RN3  29.21,24.89 0 top
U2  17.53,22.48 0 top
U5  26.67,36.83 270 top
U8  15.11,4.57 180 top
U$1  [WEEE]  17.02,0.64 0 bottom
U$2  [ROHS]  9.91,0.25 0 bottom
U$3  [OMV-LOGO]  23.88,38.99 0 bottom
U$4  [OMV-LOGO-SMALL]  7.64,11.74 0 top
U$6  [OMV-LOGO-BIG]  7.11,31.62 0 top
X1  26.67,2.86 0 top
X2  34.92,33.15 270 bottom
X3  17.78,40.64 0 top
X4  7.11,6.35 180 top
Y1  8.64,22.99 90 top

### Tracks (layer width: path | path; a pad name or v marks a point on that pad's centre or on a via)
BOOT0  (via drill 0.2, 0.25, 0.33)
  Top 0.127: U2.E8 v17.11,26.07 v17.12,26.07 | v26.75,19.89 27.33,19.3 27.33,13.3 27.68,12.96 v27.8,12.96 | RN3.3 29.61,22.67 v29.71,22.57
  Top 0.152: v32.38,12.95 32.38,15.24 JP2.2
  Bottom 0.127: v17.12,26.07 18.75,26.07 25.06,19.75 26.62,19.75 v26.75,19.89 | v27.8,12.96 27.82,12.93 32.37,12.93 v32.38,12.95
  Bottom 0.203: JP2.2 32.13,18.54 32.13,21.72 31.84,22.01 30.22,22.01 29.71,22.52 v29.71,22.57
DAC  (via drill 0.2)
  Top 0.127: U2.T3 12.37,16.52 v12.33,16.52 v12.32,16.52
  Bottom 0.127: JP1.7 2.16,4.06 11.96,13.87 11.96,16.16 v12.32,16.52
DCMI_CLK  (via drill 0.2, 0.25)
  Top 0.127: X3.12 v19.53,43.64 | U2.E15 v22.7,25.3 v22.7,25.29
  VCC 0.127: v20.72,33.76 20.72,27.02 20.73,27.02 20.73,26.7 20.71,26.68 20.71,26.02 21.03,25.7 22.3,25.7 v22.7,25.29
  Bottom 0.127: v19.53,43.64 19.53,35.8 20.68,34.65 20.68,33.81 v20.72,33.76
DCMI_D0  (via drill 0.2)
  Top 0.127: X3.31 14.53,37.2 16.39,35.35 16.39,33.61 16.77,33.23 v16.93,33.07 v16.94,33.07 | U2.F14
  Top 0.152: U2.F14 21.57,24.88 v21.95,25.26
  VCC 0.127: v21.95,25.26 21.44,24.75 19.47,24.75 19.14,25.07 19.14,32.2 19.45,32.52 19.45,32.84 19.23,33.07 v16.94,33.07
DCMI_D1  (via drill 0.2)
  Top 0.127: X3.29 15.03,37.29 16.64,35.69 16.64,33.91 v16.93,33.62 | U2.F13 21.15,25.3 v21.19,25.3
  VCC 0.127: v16.93,33.62 16.97,33.57 19.08,33.57 19.93,32.73 19.93,25.68 20.31,25.3 v21.19,25.3
DCMI_D2  (via drill 0.2)
  Top 0.127: X3.35 13.53,37.15 13.28,36.9 13.28,35.71 v13.25,35.68 | U2.C4 13.5,27.28 v13.12,27.66
  VCC 0.127: v13.12,27.66 13.12,35.53 13.26,35.66 v13.25,35.68
DCMI_D3  (via drill 0.2, 0.25)
  Top 0.127: X3.28 v15.53,43.64 | U2.B4 13.15,28.46 13.15,34.54 14.22,35.62 14.37,35.62 v14.46,35.53
  Bottom 0.127: v15.53,43.64 14.99,43.09 14.99,35.79 14.73,35.53 v14.46,35.53
DCMI_D4  (via drill 0.2, 0.25)
  Top 0.127: X3.26 v16.03,44.07 | U2.D2 11.53,26.88 v11.46,26.88
  Bottom 0.127: v11.46,26.88 11.26,26.88 10.88,26.5 10.56,26.5 10.11,26.95 10.11,33.38 10.57,33.84 15.31,33.84 16.03,34.56 v16.03,44.07
DCMI_D5
  Top 0.127: X3.33 14.03,37.18 14.76,36.45 14.76,36.4 14.9,36.26 14.9,35.37 13.54,34.01 13.54,29.31 13.87,28.98 13.87,28.5 14.29,28.08 U2.B5
DCMI_D6  (via drill 0.2, 0.25)
  Top 0.127: X3.24 v16.53,43.64 | v10.72,26.89 U2.D1
  Bottom 0.127: v10.72,26.89 10.94,27.11 10.94,33.11 11.42,33.59 15.41,33.59 16.53,34.7 v16.53,43.64
DCMI_D7  (via drill 0.2, 0.25)
  Top 0.127: X3.22 v17.03,44.07 | U2.E5 13.97,26.03 v13.93,26.03
  VCC 0.127: v13.93,26.03 14.34,26.44 14.34,27.79 14.24,27.89 14.24,34.49 14.54,34.8 15.16,34.8 15.26,34.9 16.89,34.9 v17.03,35.04
  Bottom 0.127: v17.03,35.04 v17.03,44.07
DCMI_FSIN  (via drill 0.2)
  Top 0.127: X3.23 16.53,37.06 18.15,35.45 18.15,35.21 18.14,35.2 18.14,34.88 18.42,34.59 18.42,30.54 v18.07,30.19
  VCC 0.127: v26.83,15.49 26.83,19.41 27.27,19.85 27.27,23.67 27.41,23.82 27.41,24.22 24.25,27.37 24.25,27.79 22.09,29.95 v22.09,30.1
  Bottom 0.127: v22.09,30.1 18.17,30.1 v18.07,30.19
  Bottom 0.152: v26.83,15.49 32.64,15.49 JP2.3
DCMI_HSYNC  (via drill 0.2, 0.25)
  Top 0.127: X3.18 v18.03,44.07 | U2.U3 12.35,15.71 v12.35,15.59
  VCC 0.127: v12.35,15.59 12.35,15.99 12.71,16.35 12.71,18.75 12.96,19 12.96,23.42 15.49,25.94 15.49,27.45 16.29,28.26 16.29,31.53 16.98,32.22 17.94,32.22 18.03,32.31 v18.03,32.29
  Bottom 0.127: v18.03,44.07 18.03,35.2 v18.03,32.29
DCMI_PCLK  (via drill 0.2, 0.25)
  Top 0.127: X3.14 v19.03,44.07 | v12.34,19.04 12.34,18.07 U2.R3
  VCC 0.127: v12.34,19.04 12.34,19.15 12.71,19.52 12.71,23.56 15.07,25.92 15.07,27.42 16.02,28.36 16.02,31.76 16.93,32.68 v19.06,32.68 | v19.06,32.68
  Bottom 0.127: v19.06,32.68 19.03,32.71 v19.03,44.07
DCMI_PWDN  (via drill 0.2)
  Top 0.127: X3.25 16.03,36.93 17.53,35.43 17.53,35.06 v17.56,35.03 | U2.C11 19.5,27.66 v19.54,27.66 | R7.1 15.11,32.67 v15.11,33.16
  Bottom 0.127: v19.54,27.66 19.52,27.66 17.28,29.9 17.28,32.68 | 17.28,32.68 17.28,32.85 17.42,33 17.42,34.9 v17.56,35.03 | 17.28,32.68 17.11,32.68 17.1,32.68 16.12,32.68 15.85,32.95 15.32,32.95 v15.11,33.16
DCMI_RST  (via drill 0.2)
  Top 0.127: X3.21 17.03,37.2 18.73,35.5 18.78,35.45 19.01,35.22 19.01,33.38 19.78,32.61 v21.14,32.61 | U2.D14 v21.95,26.9 | v21.95,26.9
  VCC 0.127: v21.95,26.9 21.57,27.29 21.57,28.31 21.55,28.32 21.55,28.65 21.56,28.65 21.56,29.08 21.56,32.21 21.16,32.61 v21.14,32.61
DCMI_VSYNC  (via drill 0.2, 0.25)
  Top 0.127: X3.16 v18.53,43.64 | U2.C5 13.98,27.62 v13.95,27.62
  VCC 0.127: v13.95,27.62 v13.94,27.64 13.94,34.97 14.11,35.14 14.74,35.14 15.15,35.55 18.07,35.55 18.57,35.05 18.56,35.04 v18.53,35.04
  Bottom 0.127: v18.53,43.64 18.53,43.9 18.53,35.37 v18.53,35.04
FS_D_N  (via drill 0.2)
  Top 0.22: U2.E17 23.94,25.69 24.53,25.69 24.85,25.37 25.56,25.37 26.22,24.71 26.22,10.25 25.76,9.79 | 25.76,9.79 | 25.76,9.79 v25.83,9.72 | X1.2 26.02,5.02 26.02,5.08 26.04,5.08 v26.04,5.5
  Bottom 0.22: v25.83,9.72 26.46,9.72 26.83,9.36 26.83,8.31 26.04,7.52 v26.04,5.5
FS_D_P  (via drill 0.2)
  Top 0.22: U2.E16 23.5,25.3 24.22,25.3 24.5,25.02 25.41,25.02 25.88,24.56 25.88,10.39 25.52,10.03 | 25.52,10.03 | 25.52,10.03 v25.45,10.1 | X1.3 26.67,4.99 26.64,5.02 26.64,5.07 26.56,5.14 v26.56,5.5
  Bottom 0.22: 27.07,9.61 26.58,10.1 26.07,10.1 26.01,10.16 25.64,10.16 25.58,10.1 v25.45,10.1 | 27.07,9.61 | 27.07,9.61 27.17,9.5 27.17,8.16 27.07,8.06 | 27.07,8.06 | v26.56,5.5 26.56,7.55 27.07,8.06
GND  (via drill 0.2, 0.25, 0.33, 0.41, 0.41 pad 0.61)
  Top 0.254: X3.19 v17.53,37.59 | X3.27 v15.53,37.59 | X3.5 v21.03,37.59 | U2.N1 U2.P1 11.13,18.2 10.76,17.83 10.76,16.73 11.13,16.36 U2.U1
  Top 0.305: U2.T12 v20.32,16.49 v20.32,16.48 | C5.2 C4.2 v7.01,17.65 | U2.B2 U2.A1 10.56,28.88 v10.54,28.86 | U2.J16 U2.J17 | U2.J16 U2.K15 U2.L15 U2.M15 U2.N16 | U2.U17 v23.93,15.52 v23.93,15.51 | U2.J16 22.72,22.89 22.72,23.67 U2.G16 23.52,23.69 24.17,23.69 v24.28,23.58 | U2.C10 18.71,27.66 v18.73,27.66 | U2.C13 21.1,27.65 v21.17,27.65 | v24.44,28.86 23.94,28.86 U2.A17 23.93,28.63 23.53,28.24 v23.53,27.69 U2.C16 | C48.2 26.84,25.56 v26.81,25.53 | C1.2 31.85,25.59 | 31.85,25.59 32.71,25.59 v32.78,25.66 | U2.B6 15.09,28.08 v14.7,28.46 | C49.2 16.22,33.1 v16.24,33.12 | U2.J3 12.32,22.89 v12.32,22.91 | Y1.2 C40.1 9.44,26.22 v9.46,26.25 | C5.2 C41.1 | C41.1 7.84,21.99 Y1.4 7.06,22.04 v7.04,22.01 | C41.1 7.82,20.68 v6.98,20.68 | C5.2 7.81,19.15 v6.99,19.15 | U2.R4 13.14,17.29 v13.14,17.27 | U2.R8 16.36,17.31 v16.34,17.31 | U2.U1 11.12,16.07 v11.12,15.51 | U2.P1 11.12,18.47 v10.58,18.47 | U2.J8 16.33,22.88 v16.33,22.91 | U2.J9 17.15,22.86 v17.12,22.86 | U2.H8 16.34,23.67 v16.32,23.67 | U2.K8 v16.34,22.06 | U2.L8 v16.33,21.28 | v16.33,21.28 | U2.L9 17.14,21.27 v17.14,21.29 | U2.L10 18.32,20.88 v17.92,21.28 | RN3.6 29.61,25.04 29.71,24.94 31.2,24.94 31.85,25.59 | v18.02,13 18.06,13.04 C16.2 20.12,13.04 v20.18,12.99
  Top 0.406: R2.1 v1.02,27.05 | Q1.2 4.25,23 v4.24,22.99
  Top 0.55: U8.2 v15.11,4.57
  Top 0.61: C14.C v25.65,41.66
  GND 0.305: v21.17,27.65 22.03,27.65 22.62,28.25 23.02,28.25 23.3,27.96 23.3,27.92 v23.53,27.69
  Bottom 0.305: v24.28,23.58 23.85,24 X2.G$4 | 15.88,22.47 15.88,23.2 C9.2 C13.2 | 15.88,22.47 C8.2 16,21.76 | C13.2 17.27,23.2 17.27,22.7 | 17.27,22.7 17.27,21.76 | 17.27,21.76 C6.2 17.62,21.28 v17.92,21.28 | 16,21.76 17.27,21.76 | C11.C 17.48,22.99 C13.2 | v16.33,21.28 16.33,21.43 16,21.76 | v16.34,22.06 16.28,22.06 15.88,22.47 | v16.33,22.91 16.75,23.33 C13.2 | v17.12,22.86 17.27,22.7
  Bottom 0.406: X2.CD$2 v28.52,20.27 | X2.G$2 v32.65,32.9 | X2.G$3 v23.85,32.36 | v34.54,22.99 X2.G$1
  other vias: 4.32,16.76 7.11,12.95 4.32,18.67 4.32,14.99 30.61,30.35 28.83,5.46 27.94,5.46 5.84,12.95 30.61,29.59 14.22,4.57 16.13,4.57 17.91,3.72 17.14,3.72 11.05,5.33 25.78,34.92 27.94,36.83 26.67,36.83 24.26,34.16 11.05,4.19 11.05,6.48
  pour GND (isolate 0.305): 0,0 0,44.45 35.56,44.45 35.56,0
  pour Top (isolate 0.254, no thermals): 30.35,29.34 34.67,29.34 34.67,31.5 30.35,31.5
  pour Top (isolate 0.254, rank 5, no thermals): 27.27,3.49 27.27,7.36 30.69,7.36 30.69,3.49
  pour Top (isolate 0.254, rank 3, no thermals): 10.41,6.99 18.29,6.99 18.29,2.03 16.89,2.03 16.89,3.05 16.89,4.19 11.94,4.19 11.94,2.79 10.41,2.79
  pour Bottom (isolate 0.254, no thermals): 30.35,29.21 34.67,29.21 34.67,30.73 30.35,30.73
  pour Top (isolate 0.254, rank 5, no thermals): 22.99,37.08 30.35,37.08 30.35,33.78 22.99,33.78
  pour Top: 15.62,24.26 15.62,20.57 19.43,20.57 19.43,24.26
I2C1_SCL  (via drill 0.2, 0.25)
  Top 0.127: X3.32 14.53,43.69 v14.15,44.07 10.54,44.07 9.02,42.55 R3.2 | U2.D5 v13.93,26.88
  VCC 0.127: v13.93,26.88 13.52,27.29 13.52,35.22 14.38,36.09 v14.48,36.09
  Bottom 0.127: v14.48,36.09 14.41,36.15 14.41,43.81 v14.15,44.07
I2C1_SDA  (via drill 0.2, 0.25)
  Top 0.127: X3.34 14.03,43.26 v13.65,43.64 11.51,43.64 10.54,42.67 R4.2 | U2.D4 13.5,26.48 v13.15,26.83
  VCC 0.127: v13.15,26.83 12.71,27.27 12.71,35.81 13.03,36.13 v13.78,36.13
  Bottom 0.127: v13.78,36.13 13.78,43.51 v13.65,43.64
I2C2_SCL  (via drill 0.2)
  Top 0.127: U2.P11 18.77,18.13 v18.77,18.09 | v8.6,9.03 1.77,9.03 JP1.5
  VCC 0.127: v18.77,18.09 18.77,10.34 17.46,9.03 v8.6,9.03
I2C2_SDA  (via drill 0.2)
  Top 0.127: U2.P12 19.93,18.43 v19.57,18.08 | v8.62,8.39 8.57,8.33 3.38,8.33 JP1.6
  VCC 0.127: v8.62,8.39 18.18,8.39 19.57,9.77 v19.57,18.08
LED_B  (via drill 0.2)
  Top 0.127: U2.M3 12.33,19.68 v12.32,19.68 | v8.12,29.72 8.1,29.7 RN1.6
  Bottom 0.127: v12.32,19.68 12.11,19.68 11.72,19.29 10.83,19.29 8.26,21.87 8.26,29.59 v8.13,29.72 v8.12,29.72
LED_G  (via drill 0.2)
  Top 0.127: U2.M2 11.51,19.66 v11.48,19.68 | v8.51,30.48 7.21,30.48 RN1.7
  Bottom 0.127: v11.48,19.68 10.79,19.68 8.51,21.97 v8.51,30.48
LED_IR
  Top 0.127: U2.C3 12.36,27.65 8.44,27.65 RN1.5
LED_R  (via drill 0.2)
  Top 0.127: U2.L2 11.52,20.47 v11.52,20.45 | v9.02,31.24 8.96,31.3 RN1.8
  Bottom 0.127: v11.52,20.45 v11.51,20.45 10.41,20.45 9.02,21.84 v9.02,31.24
N$1  (via drill 0.25)
  other vias: 3.05,43.43
N$2
  Top 0.127: U2.J2 11.43,22.98 11,22.98 10.99,22.99 8.38,22.99 7.89,23.48 7.89,23.75 Y1.3 7.89,25.35 C40.2
N$3  (via drill 0.25)
  other vias: 5.08,41.4
N$4
  Top 0.127: U2.J1 10.68,22.04 Y1.1 C41.2
N$5
  Top 0.254: Q1.1 2.35,26.52 3.27,27.43 4.83,27.43 5.64,28.24 RN1.4
  Top 0.406: Q1.1 1.17,24.02 R2.2
N$6
  Top 0.254: RN1.3 4.93,29.7 3.83,28.6 LED1.B
N$7
  pour Top (isolate 0.254, rank 2, no thermals): 24.64,6.99 23.37,6.99 23.37,3.53 24.77,3.53 25.48,3.53 25.48,6.99
N$8
  Top 0.254: RN1.1 4.76,31.3 3.94,30.48 1.78,30.48 1.46,30.8 LED1.R
N$9
  Top 0.254: RN1.2 4.84,30.5 4.06,29.72 1.78,29.72 1.46,29.4 LED1.G
N$10  (via drill 0.41, 0.41 pad 0.61)
  Top 0.406: LED3.C v7.24,38.73 | R1.2 5.71,23.11 v5.84,22.99
  Bottom 0.406: v7.24,38.73 7.24,24.38 v5.84,22.99
N$11
  Top 0.61: U5.4 27.97,35.4 28.19,35.18 28.19,34.45 C7.1
N$13
  Top 0.406: R5.2 R10.1 U8.4
N$14
  Top 0.406: Q1.3 5.46,26.12 R1.1
N$15  (via drill 0.25)
  other vias: 1.02,41.4
N$16  (via drill 0.25)
  other vias: 3.05,39.37
N$17  (via drill 0.41)
  Top 0.406: LED3.A v8.97,43.51 | v27,43.51 LED2.C
  VCC 0.406: v24,42.55 23.5,42.04 12.19,42.04 v11.68,42.55
  Bottom 0.406: v11.68,42.55 9.93,42.55 v8.97,43.51 | v24,42.55 24.97,43.51 v27,43.51
N$18  (via drill 0.25)
  other vias: 4.45,42.8
N$19  (via drill 0.25)
  other vias: 1.65,42.8
N$20  (via drill 0.25)
  other vias: 1.65,40.01
N$21  (via drill 0.25)
  other vias: 4.45,40.01
N$22  (via drill 0.25)
  other vias: 32.51,43.43
N$23  (via drill 0.25)
  other vias: 30.48,41.4
N$24  (via drill 0.25)
  other vias: 34.54,41.4
N$25  (via drill 0.25)
  other vias: 32.51,39.37
N$26  (via drill 0.25)
  other vias: 31.11,42.8
N$27  (via drill 0.25)
  other vias: 31.11,40.01
N$28  (via drill 0.25)
  other vias: 33.91,42.8
N$29  (via drill 0.25)
  other vias: 33.91,40.01
N$31  (via drill 0.2)
  Top 0.127: U2.D15 22.75,26.9 v22.76,26.9 | R8.1 v23.15,13.98
  VCC 0.127: v22.76,26.9 23.5,26.16 23.5,21.41 22.76,20.67 22.76,14.37 v23.15,13.98
N$32
  Top 0.254: C5.1 9.44,19.05 10.1,19.05 U2.M1 10.98,20.23 10.98,20.73 U2.L1
  Top 0.305: C5.1 C4.1 9.44,16.32 L1.1
N$33
  Top 0.127: U2.A7 15.93,30.38 C49.1
N$34
  Top 0.305: U2.D17 23.99,26.54 C48.1
N$35
  Top 0.254: C16.1 19.05,16 U2.U11
NRST  (via drill 0.2, 0.33)
  Top 0.127: U2.K1 10.69,21.24 v10.65,21.24
  Top 0.152: JP2.1 31.62,17.02 31.62,13.21 JP3.4
  Top 0.305: v30.61,22.65 30.61,23.92 RN3.4 30.53,24 C1.1
  Bottom 0.127: v10.65,21.24 11.38,21.24 13.58,19.04 26.68,19.04 27.42,19.78 27.42,22.15 27.93,22.65 29.1,22.65 29.51,23.06 29.91,23.06 30.32,22.65 30.66,22.65
  Bottom 0.203: JP2.1 33.15,20.07 33.15,21.72 32.21,22.65 30.66,22.65 v30.61,22.65
RAW
  pour Top (isolate 0.254, rank 2, no thermals): 21.84,4.32 21.84,0.25 20.19,0.25 20.19,3.84 18.41,3.84 18.41,5.31 13.94,5.31 13.94,6.99 19.43,6.99 19.43,4.32
SD_CD  (via drill 0.2)
  Top 0.127: U2.D13 21.11,26.86 v21.15,26.86 | v27.26,27.81 27.25,27.82 RN2.5
  Bottom 0.127: v27.26,27.81 27.15,27.93 24.4,27.93 23.77,27.3 23.37,27.3 23.29,27.37 21.82,27.37 21.45,27.01 21.3,27.01 v21.15,26.86 20.71,26.42 20.71,25.23 21.02,24.91 21.32,24.91 X2.CD$1
SDIO_CLK  (via drill 0.2, 0.33)
  Top 0.127: U2.C12 19.95,27.28 v20.32,27.65 | v29.46,28.34 30.5,28.34 v30.61,28.45
  Bottom 0.127: v20.32,27.65 v20.33,27.65 20.74,28.06 22.1,28.06 22.51,28.47 29.34,28.47 v29.46,28.34
  Bottom 0.203: v30.61,28.45 X2.P$5
SDIO_CMD  (via drill 0.2, 0.33)
  Top 0.152: U2.D12 19.95,26.48 v20.34,26.86
  Top 0.203: RN2.8 v29.65,29.84
  Bottom 0.127: v20.34,26.86 20.34,26.91 20.68,27.26 21.34,27.26 21.57,27.49 21.57,27.8 22.2,27.8 22.61,28.22 28.92,28.22 29.19,27.95 29.91,27.95 29.92,27.95
  Bottom 0.203: X2.P$3 30.96,26.24 29.92,27.29 29.92,27.95 | v29.65,29.84 29.91,29.59 29.91,27.95
SDIO_D0  (via drill 0.2, 0.33)
  Top 0.127: U2.E13 v21.16,26.11 v21.16,26.12 | v29.07,27.49 29.07,28.93 29.05,28.96 29.05,29.65 v28.85,29.84
  Top 0.203: RN2.7 v28.85,29.84
  Bottom 0.127: v21.16,26.12 21.18,26.12 21.57,26.51 24.23,26.51 25.38,27.66 26.86,27.66 27.1,27.42 27.42,27.42 27.66,27.66 28.91,27.66 v29.07,27.49
  Bottom 0.203: v28.85,29.84 28.85,30.12 29.84,31.11 33.66,31.11 34.13,30.64 X2.P$7
SDIO_D1  (via drill 0.2, 0.33)
  Top 0.127: U2.E14 v21.96,26.11 | v26.02,27.27 26.02,30.8 26.57,31.35 27.82,31.35 28.05,31.13 RN2.6
  Top 0.203: RN2.6 v28.05,29.84
  Bottom 0.127: v26.02,27.27 25.44,27.27 24.29,26.11 v21.96,26.11
  Bottom 0.203: X2.P$8 29.02,31.69 RN2.6 v28.05,29.84
SDIO_D2  (via drill 0.2, 0.33)
  Top 0.127: U2.A13 21.09,29.24 v21.17,29.24 | v27.9,29.22 27.9,26.68 v27.88,26.67
  Top 0.203: v27.88,26.67 28.01,26.54 RN3.8
  Bottom 0.127: v21.17,29.24 21.53,29.6 27.52,29.6 v27.9,29.22
  Bottom 0.203: X2.P$1 29,24.04 27.88,25.16 v27.88,26.67
SDIO_D3  (via drill 0.2, 0.33)
  Top 0.127: U2.B13 21.11,28.47 v21.16,28.47 | v28.62,28.93 28.68,28.93 v28.68,26.67
  Top 0.203: v28.68,26.67 28.81,26.54 RN3.7
  Bottom 0.127: v21.16,28.47 21.67,28.98 24.01,28.98 24.28,29.25 24.6,29.25 24.87,28.98 27.58,28.98 27.84,28.73 28.41,28.73 v28.62,28.93
  Bottom 0.203: X2.P$2 28.7,25.14 28.68,25.16 v28.68,26.67
SPI2_MISO  (via drill 0.2)
  Top 0.127: U2.U15 22.33,12.29 20.32,10.29 6.48,10.29 v6.35,10.41
  Bottom 0.127: v6.35,10.41 6.22,10.41 5.08,11.56
  Bottom 0.152: 5.08,11.56 3.05,13.59 3.05,15.37 JP1.2
SPI2_MOSI
  Top 0.127: U2.T15 22.02,17.18 21.4,17.18 21.22,17 21.22,12.92 20.17,11.86 9.09,11.86 4.61,16.34 4.14,16.34 1.65,18.84 JP1.1
SPI2_NSS
  Top 0.127: U2.T14 21.53,16.79 21.96,16.35 21.96,12.29 20.84,11.17 4.16,11.17 3.64,11.68 JP1.4
SPI2_SCLK
  Top 0.127: U2.U14 21.57,16.04 21.57,12.67 20.46,11.56 5.06,11.56 2.4,14.22 JP1.3
SPI3_MISO  (via drill 0.2)
  Top 0.127: X3.15 18.53,36.97 20.14,35.36 v20.14,33.97 | U2.B7 v15.54,28.46 v15.54,28.47
  VCC 0.127: v15.54,28.47 15.54,33.71 15.92,34.09 20.01,34.09 v20.14,33.97
SPI3_MOSI  (via drill 0.2)
  Top 0.127: X3.17 18.03,36.83 19.42,35.44 v19.42,34.75 | U2.A5 14.33,29.06 13.93,29.46 13.93,33.94 14.32,34.33 v14.63,34.33
  Top 0.152: v14.63,34.33
  VCC 0.127: v14.63,34.33 15.06,34.33 15.37,34.64 19.26,34.64 19.37,34.75 v19.42,34.75
SPI3_SCLK/TRACESWO  (via drill 0.2)
  Top 0.127: X3.13 19.03,37.1 21.14,34.99 v21.14,34.36 | U2.C6 v14.75,27.65 | v14.75,27.65
  VCC 0.127: v21.14,34.36 15.44,34.36 15.16,34.08 14.96,34.08 14.63,33.75 14.63,29.53 15.1,29.06 15.1,28.3 14.75,27.96 v14.75,27.65 14.75,26.02 11.93,23.2 11.93,14.76 v12.37,14.31
  Bottom 0.127: JP3.1 27.43,16.64 26.49,16.64 26.29,16.64 20.71,16.64 20.48,16.87 14.93,16.87 v12.37,14.31
SPI3_SSEL  (via drill 0.25)
  Top 0.127: X3.11 19.53,37.37 v20.45,36.45 21.53,35.36 21.53,30.62 21.56,30.59 21.56,29.08 21.53,29.05 U2.A14
SW
  pour Top (isolate 0.254, no thermals): 15.62,3.81 16.51,3.81 16.51,0.25 15.62,0.25
SWCLK  (via drill 0.2)
  Top 0.127: U2.B14 v21.93,28.49 v21.94,28.49
  VCC 0.127: v21.94,28.49 22.43,28 22.43,27.6 22.66,27.37 22.84,27.37 25.48,24.73 25.48,16.25 v25.44,16.25
  Bottom 0.127: v25.44,16.25 25.86,16.25 25.98,16.13
  Bottom 0.152: 25.98,16.13 29.46,16.13 JP3.2
SWDIO  (via drill 0.2)
  Top 0.127: 26.87,20.88 26.87,21.49 v26.88,21.5 | U2.C15 v22.81,27.77 v22.82,27.77
  Top 0.152: 26.87,20.88 28.83,18.92 28.83,15.49 JP3.3
  VCC 0.127: v22.82,27.77 26.88,23.7 v26.88,21.5
TIM4_CH1
  Top 0.127: U2.R16 23.5,17.3 23.93,17.3 24.36,16.87 24.36,8.67 25.19,7.85 32.96,7.85 33.91,6.9 JP2.6
TIM4_CH2  (via drill 0.2)
  Top 0.127: U2.R17 24.63,16.97 24.63,9.32 25.71,8.24 v27.91,8.24
  Bottom 0.127: JP2.5 32.56,7.8 28.36,7.8 v27.91,8.24
TIM4_CH3  (via drill 0.2, 0.25)
  Top 0.127: U2.P16 23.56,18.04 24.33,18.04 24.9,17.48 24.9,11.55 v25.41,11.03
  Top 0.152: JP2.4 32.64,10.41 29.46,10.41 v28.96,10.92
  Bottom 0.127: v25.41,11.03 28.85,11.03 v28.96,10.92
VBUS
  Top 0.254: R8.2 23.15,7.31 L2.2
  pour Top (isolate 0.254, rank 3, no thermals): 19.81,5.59 21.72,5.59 21.72,6.99 22.86,6.99 22.86,5.21 21.84,5.21 21.84,4.7 19.81,4.7
VCC  (via drill 0.2, 0.25, 0.33, 0.41)
  Top 0.152: 23.7,37.78 C3.2 | 25.37,38.77 v25.27,38.86 | U2.E7 15.93,25.17 15.9,25.15
  Top 0.203: RN3.2 v28.82,23.33 | RN3.1 v28.01,23.33 | RN3.5 30.41,26.01 | RN2.2 v28.85,33.15 | RN2.3 v28.05,33.15
  Top 0.254: RN2.4 v27.25,33.15 | RN2.1 v29.65,33.15 | R4.1 v10.54,38.73 | R3.1 v9.02,38.73 | X3.30 15.03,43.81 v14.9,43.94 | X3.10 20.03,43.4 20.28,43.65 v20.28,43.94 | U2.C17 24.18,27.54 v24.65,27.54 | U5.3 24.51,35.88 24.51,37.78 | 24.51,37.78 U5.1 25.37,38.77 | 24.51,37.78 23.7,37.78
  Top 0.305: X3.20 v17.53,43.64 | U2.E9 17.93,25.27 | 17.93,25.27 18.8,25.27 | 18.8,25.27 19.13,25.6 U2.E11 | 18.8,25.27 19.53,25.27 U2.G13 U2.H13 U2.J13 U2.K13 U2.L13 U2.M13 | U2.N8 U2.N7 15.68,19.28 15.29,19.67 14.73,19.67 U2.M5 U2.L5 | U2.N8 17.26,19.81 17.79,19.81 U2.N10 U2.N11 U2.N12 U2.M13 | U2.L5 U2.K5 14.86,22.21 14.86,22.86 14.44,23.28 U2.H5 U2.G5 U2.F5 U2.E6 15.66,25.15 15.9,25.15 17.8,25.15 17.93,25.27 | U2.U12 20.36,15.64 v20.36,15.63 | L1.2 7.85,15.46 v7.84,15.45 | U2.B1 v10.51,28.08 v10.51,28.09 | R7.2 | U2.A6 v15.13,29.59 14.71,30 R7.2 | U2.P17 v24.49,18.48 | U2.F17 24.57,24.24 24.57,24.23 v24.88,24.23 | U2.L5 14.34,20.89 v14.84,20.89 | U2.N8 16.73,19.89 v16.59,20.03 | U2.M13 20.52,19.88 20.47,19.88 v20.09,20.26 | 30.41,26.01 30.41,26.35 v31.11,27.05
  Top 0.61: LED2.A v28.32,39.12
  Bottom 0.305: C8.1 C6.1 | C6.1 17.43,20.19 C11.A | C8.1 14.9,20.03 14.22,20.7 14.22,24.51 14.64,24.93 C9.1 C13.1 | v15.13,29.59 15.13,29.56 16.02,28.67 16.02,28.27 15.52,27.77 15.52,27.69 16.25,26.97 v16.25,26.89 | v16.59,20.03 C8.1 | C8.1 | v16.59,20.03 | v16.59,20.03 C6.1
  other vias: 3.43,32.77 2.41,32.77 24.13,38.86 22.99,43.81 22.99,42.93 32,27.05 12.95,43.18 13.21,0.51 12.45,0.51 11.56,0.51 10.67,0.51
  pour VCC (isolate 0.305): 0.38,0.29 0.38,44.07 35.18,44.07 35.18,0.29
  pour Top (isolate 0.254, no thermals): 30.35,26.67 34.67,26.67 34.67,28.7 30.35,28.7
  pour Top (isolate 0.254, no thermals): 2.03,33.02 2.03,30.99 3.81,30.99 3.81,33.02
  pour Top (isolate 0.254, rank 4, no thermals): 14.48,2.29 14.48,0.25 10.41,0.25 10.41,2.29 11.68,2.29
  pour Top (isolate 0.254, no thermals): 21.97,44.2 21.97,42.42 26.42,42.42 26.42,44.2
  pour Bottom (isolate 0.254, no thermals): 30.35,26.67 34.67,26.67 34.67,28.32 30.35,28.32
  pour Top (isolate 0.254, no thermals): 22.99,39.24 25.91,39.24 25.91,37.47 22.99,37.47
  pour Top (isolate 0.254, no thermals): 12.7,43.56 12.7,42.29 13.65,42.29 13.65,43.56
VDDA  (via drill 0.41)
  Top 0.33: X3.4 v21.53,43.82
  Bottom 0.61: v26.8,38.86 25.02,40.64 22.86,40.64 21.53,41.97 v21.53,43.82
  other vias: 26.8,37.97
  pour Bottom (isolate 0.254, rank 2, no thermals): 27.62,39.24 26.42,39.24 26.42,37.54 27.62,37.54
  pour Top (isolate 0.254, rank 2, no thermals): 26.42,37.54 30.35,37.54 30.35,38.42 27.62,38.42 27.62,39.24 26.42,39.24
VIN  (via drill 0.33)
  Bottom 1.016: JP2.7 22.99,4.06 21.08,2.16 v18.67,2.16 8.38,2.16 6.11,4.43 X4.1
  other vias: 19.43,2.16
  pour Top (isolate 0.254, no thermals): 16.89,0.25 16.89,1.52 18.41,1.52 18.41,3.45 19.68,3.45 19.68,0.25

### Text on the board
tPlace: P0 | SWO | RST | P1 | SWC | BOOT | P2 | SWD | SYN | P3 | RST | P9 | P4 | P8 | 3.3v | P5 | GND | P7 | P6 | VIN | 3.3V | GND
bPlace: https://openmv.io | OpenMV-H7 Alt R2 | 06/01/21 | LED1=Red | LED2=Green | LED3=Blue | LED4=IR | P0 | Pin List | SWO | RST | P1 | P0=PB15/MOSI | SWC | P1=PB14/MISO | BOOT | P2 | P2=PB13/SCLK | SWD | SYN | P3=PB12/SS | P3 | P4=PB10/TXD/SCL | RST | P9 | P5=PB11/RXD/SDA | P4 | P6=PA5/ADC/DAC | P8 | P7=PD12/SERVO1 | 3.3v | P8=PD13/SERVO2 | P5 | P9=PD14/SERVO3 | GND | P7 | P6 | Max voltage: 5v | VIN | 3.3V | GND